# EAGLE schematic Flightcontroller (EAGLE 9.3.2)

## Sheet 1 of 10: STMF722RET6
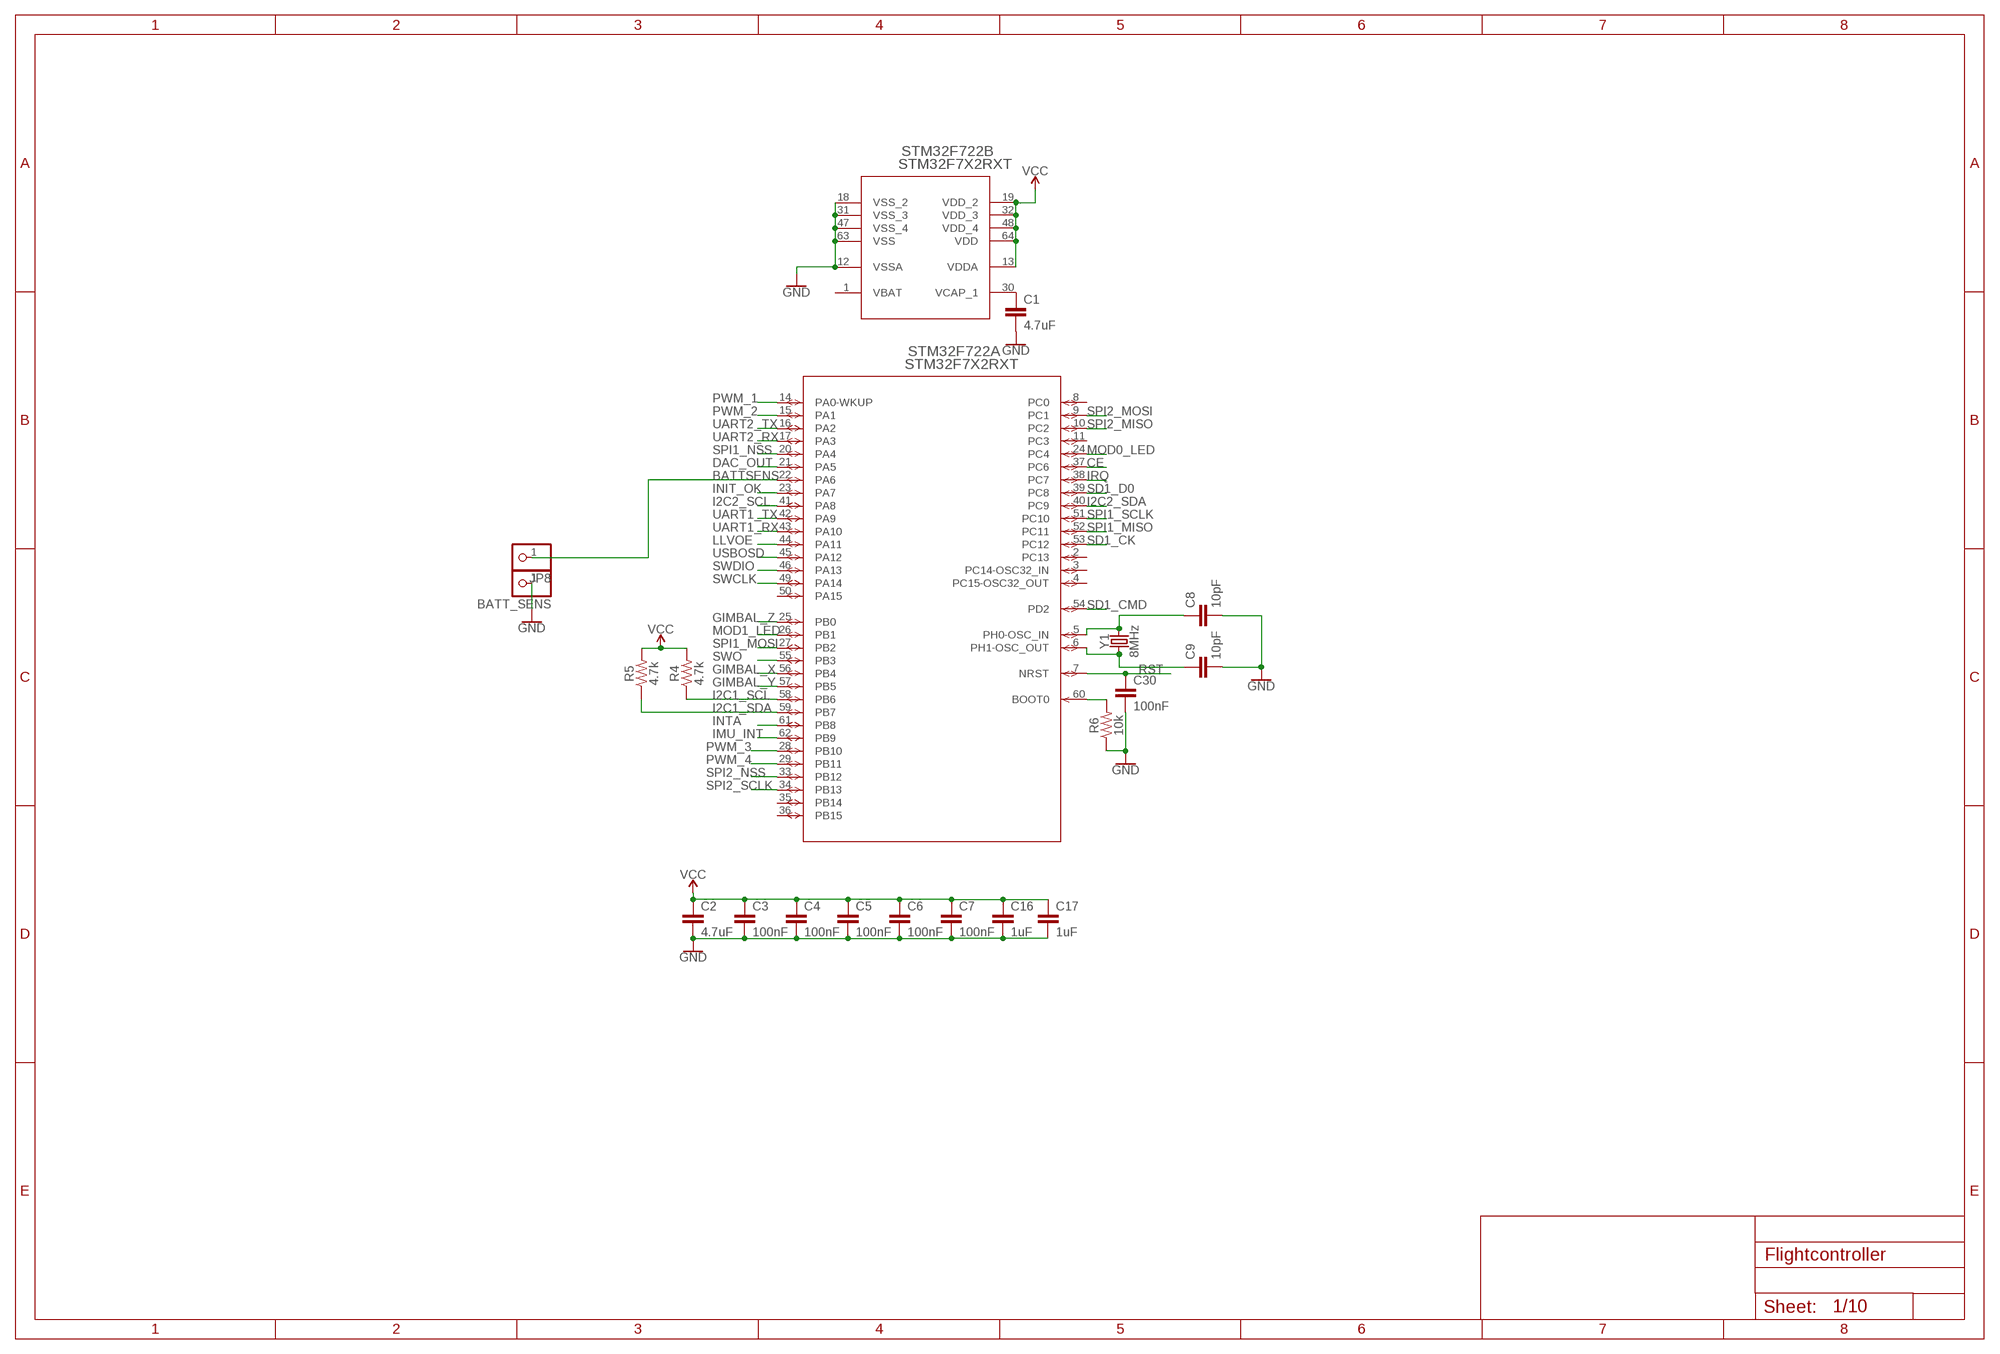
[diagram p0: schematic, sheet 1]

### Parts
BATT_SENS  PINHD-1X1  [1X01]
C1  4.7uF  C-EUC0805  [C0805]
C2  4.7uF  C-EUC0805  [C0805]
C3  100nF  C-EUC0805  [C0805]
C4  100nF  C-EUC0805  [C0805]
C5  100nF  C-EUC0805  [C0805]
C6  100nF  C-EUC0805  [C0805]
C7  100nF  C-EUC0805  [C0805]
C8  10pF  C-EUC0805  [C0805]
C9  10pF  C-EUC0805  [C0805]
C16  1uF  C-EUC0805  [C0805]
C17  1uF  C-EUC0805  [C0805]
C30  100nF  C-EUC0805  [C0805]
JP8  PINHD-1X1  [1X01]
R4  4.7k  4.7KOHM-0603-1/10W-1%  [0603]
R5  4.7k  4.7KOHM-0603-1/10W-1%  [0603]
R6  10k  10KOHM-0603-1/10W-1%  [0603]
STM32F722  STM32F7X2RXT  [LQFP64-10X10MM]
Y1  8MHz  CRYSTAL-8MHZSMD-5X3.2  [CRYSTAL-SMD-5X3.2-4PAD]

### Nets
BATTSENS: JP8.1 STM32F722.22(A:PA6)
CE: STM32F722.37(A:PC6) ; also sheet 5
DAC_OUT: STM32F722.21(A:PA5) ; also sheet 2
GIMBAL_X: STM32F722.56(A:PB4) ; also sheet 2
GIMBAL_Y: STM32F722.57(A:PB5) ; also sheet 2
GIMBAL_Z: STM32F722.25(A:PB0) ; also sheet 2
GND [Supply]: BATT_SENS.1 C1.2 C2.2 C3.2 C4.2 C5.2 C6.2 C7.2 C8.2 C9.2 C16.2 C17.2 C30.2 R6.1 STM32F722.12(B:VSSA) STM32F722.18(B:VSS_2) STM32F722.31(B:VSS_3) STM32F722.47(B:VSS_4) STM32F722.63(B:VSS) ; also sheet 2,3,4,5,6,7,8,9
I2C1_SCL: R4.1 STM32F722.58(A:PB6) ; also sheet 7
I2C1_SDA: R5.1 STM32F722.59(A:PB7) ; also sheet 7
I2C2_SCL: STM32F722.41(A:PA8) ; also sheet 8
I2C2_SDA: STM32F722.40(A:PC9) ; also sheet 8
IMU_INT: STM32F722.62(A:PB9) ; also sheet 7
INIT_OK: STM32F722.23(A:PA7) ; also sheet 2
INTA: STM32F722.61(A:PB8) ; also sheet 7
IRQ: STM32F722.38(A:PC7) ; also sheet 5
LLVOE: STM32F722.44(A:PA11) ; also sheet 9
MOD0_LED: STM32F722.24(A:PC4) ; also sheet 2
MOD1_LED: STM32F722.26(A:PB1) ; also sheet 2
N$1: C1.1 STM32F722.30(B:VCAP_1)
N$2: C8.1 STM32F722.5(A:PH0-OSC_IN) Y1.3
N$3: C9.1 STM32F722.6(A:PH1-OSC_OUT) Y1.1
N$8: R6.2 STM32F722.60(A:BOOT0)
PWM_1: STM32F722.14(A:PA0-WKUP) ; also sheet 2
PWM_2: STM32F722.15(A:PA1) ; also sheet 2
PWM_3: STM32F722.28(A:PB10) ; also sheet 2
PWM_4: STM32F722.29(A:PB11) ; also sheet 2
RST: C30.1 STM32F722.7(A:NRST) ; also sheet 2,6,8
SD1_CK: STM32F722.53(A:PC12) ; also sheet 4
SD1_CMD: STM32F722.54(A:PD2) ; also sheet 4
SD1_D0: STM32F722.39(A:PC8) ; also sheet 4
SPI1_MISO: STM32F722.52(A:PC11) ; also sheet 7
SPI1_MOSI: STM32F722.27(A:PB2) ; also sheet 7
SPI1_NSS: STM32F722.20(A:PA4) ; also sheet 7
SPI1_SCLK: STM32F722.51(A:PC10) ; also sheet 7
SPI2_MISO: STM32F722.10(A:PC2) ; also sheet 5
SPI2_MOSI: STM32F722.9(A:PC1) ; also sheet 5
SPI2_NSS: STM32F722.33(A:PB12) ; also sheet 5
SPI2_SCLK: STM32F722.34(A:PB13) ; also sheet 5
SWCLK: STM32F722.49(A:PA14) ; also sheet 2
SWDIO: STM32F722.46(A:PA13) ; also sheet 2
SWO: STM32F722.55(A:PB3) ; also sheet 2
UART1_RX: STM32F722.43(A:PA10) ; also sheet 2,6
UART1_TX: STM32F722.42(A:PA9) ; also sheet 2,6
UART2_RX: STM32F722.17(A:PA3) ; also sheet 2
UART2_TX: STM32F722.16(A:PA2) ; also sheet 2
USBOSD: STM32F722.45(A:PA12) ; also sheet 2
VCC [Supply]: C2.1 C3.1 C4.1 C5.1 C6.1 C7.1 C16.1 C17.1 R4.2 R5.2 STM32F722.13(B:VDDA) STM32F722.19(B:VDD_2) STM32F722.32(B:VDD_3) STM32F722.48(B:VDD_4) STM32F722.64(B:VDD) ; also sheet 2,3,4,5,6,7,8,9
Unconnected: STM32F722.2(A:PC13) STM32F722.3(A:PC14-OSC32_IN) STM32F722.4(A:PC15-OSC32_OUT) STM32F722.8(A:PC0) STM32F722.11(A:PC3) STM32F722.35(A:PB14) STM32F722.36(A:PB15) STM32F722.50(A:PA15)

## Sheet 2 of 10: Pinheaders and LED
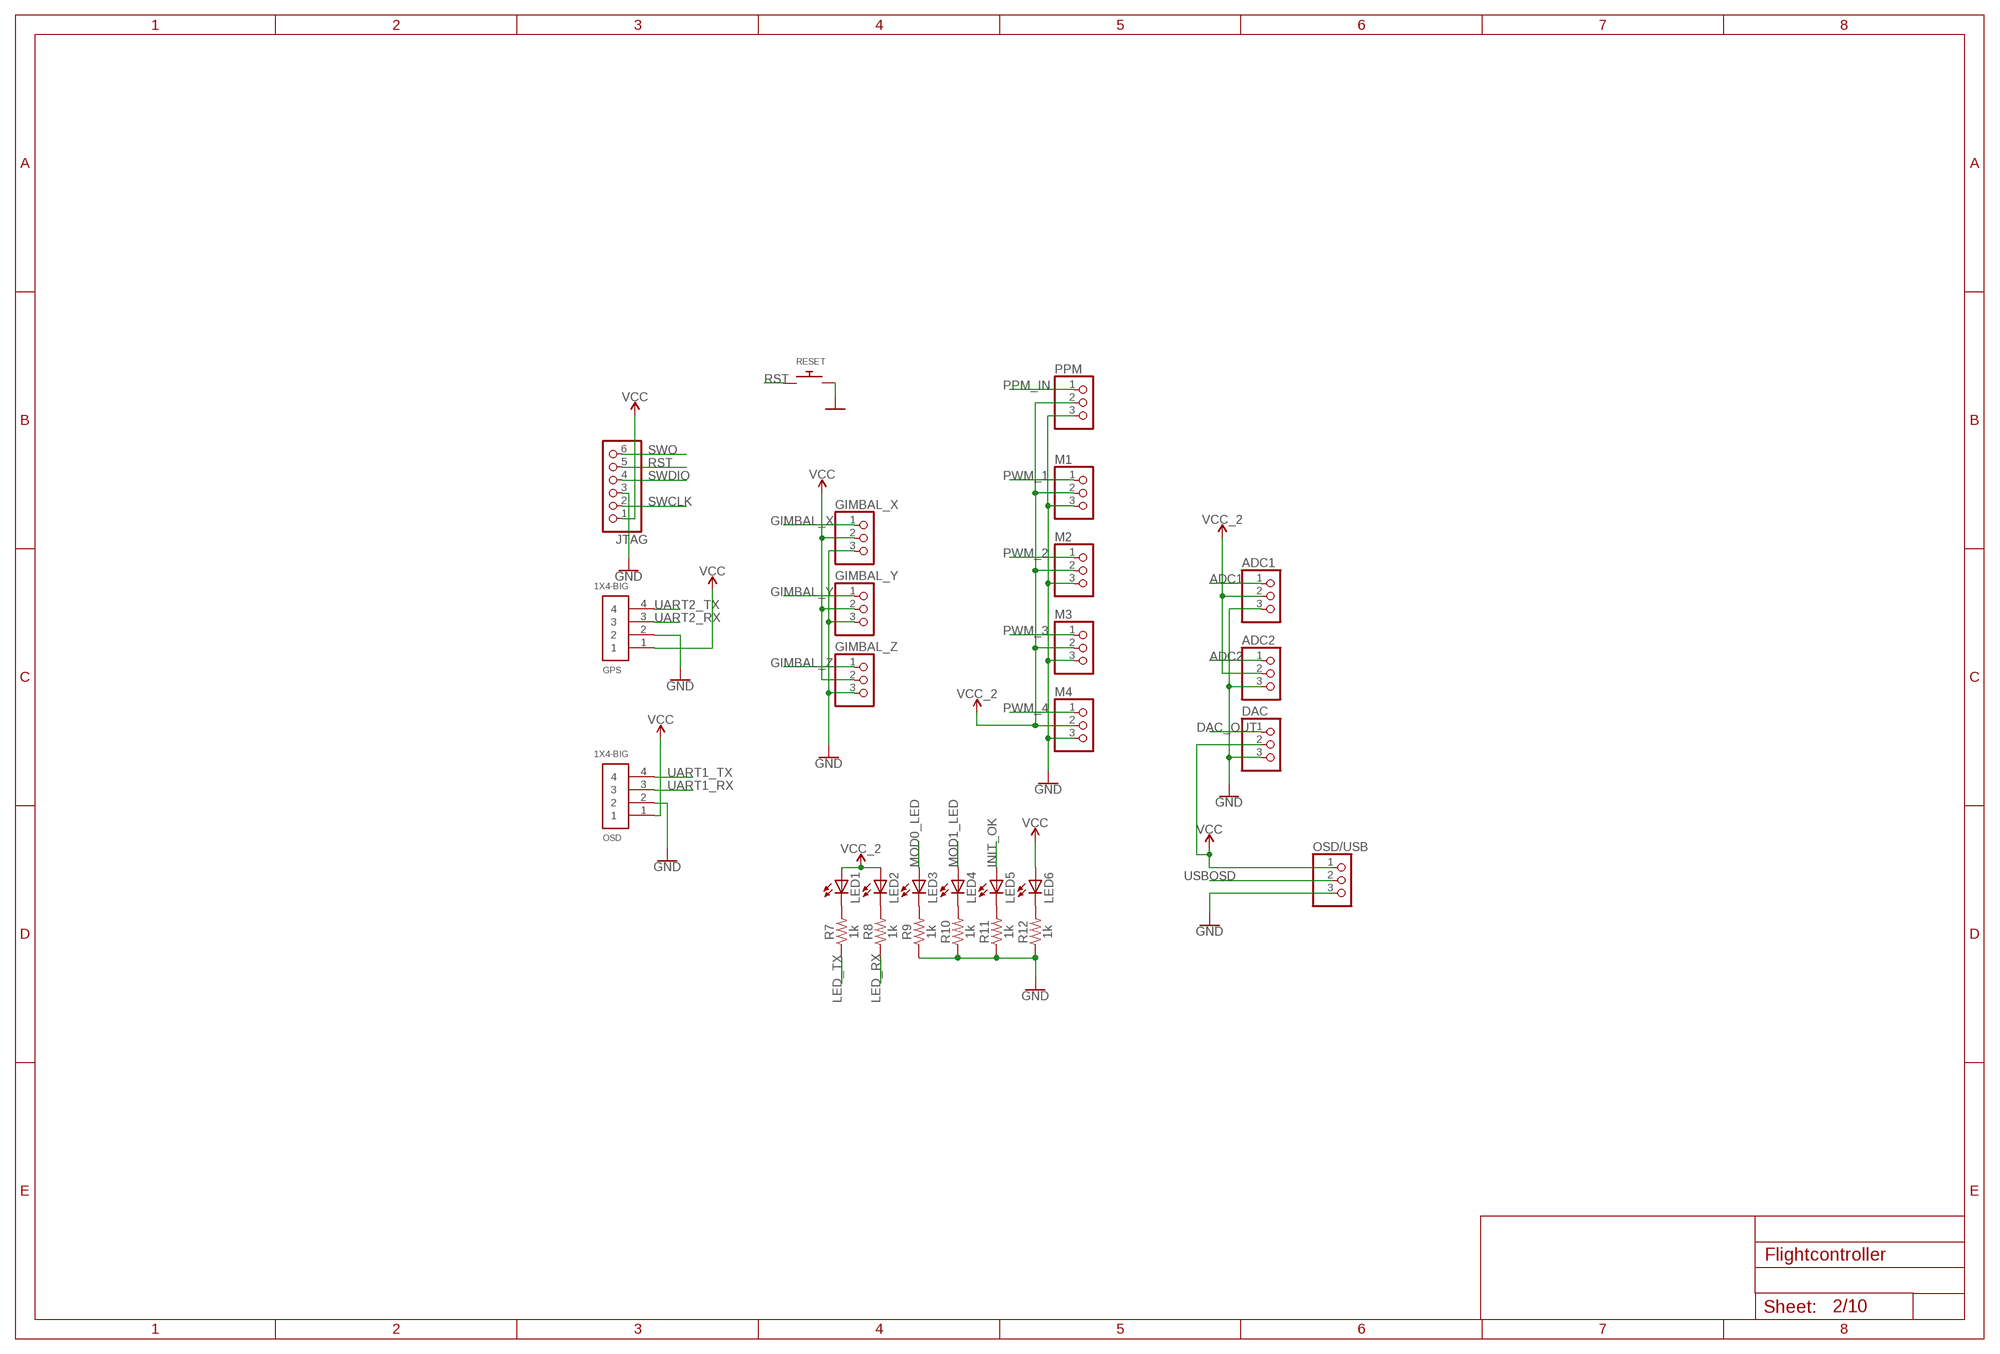
[diagram p1: schematic, sheet 2]

### Parts
ADC1  PINHD-1X3  [1X03]
ADC2  PINHD-1X3  [1X03]
DAC  PINHD-1X3  [1X03]
GIMBAL_X  PINHD-1X3  [1X03]
GIMBAL_Y  PINHD-1X3  [1X03]
GIMBAL_Z  PINHD-1X3  [1X03]
GPS  1X4-BIG  [1X04-BIG]
JTAG  PINHD-1X6  [1X06]
LED1  LEDSMT1206  [1206]
LED2  LEDSMT1206  [1206]
LED3  LEDSMT1206  [1206]
LED4  LEDSMT1206  [1206]
LED5  LEDSMT1206  [1206]
LED6  LEDSMT1206  [1206]
M1  PINHD-1X3  [1X03]
M2  PINHD-1X3  [1X03]
M3  PINHD-1X3  [1X03]
M4  PINHD-1X3  [1X03]
OSD  1X4-BIG  [1X04-BIG]
OSD/USB  PINHD-1X3  [1X03]
PPM  PINHD-1X3  [1X03]
R7  1k  10KOHM-0603-1/10W-1%  [0603]
R8  1k  10KOHM-0603-1/10W-1%  [0603]
R9  1k  10KOHM-0603-1/10W-1%  [0603]
R10  1k  10KOHM-0603-1/10W-1%  [0603]
R11  1k  10KOHM-0603-1/10W-1%  [0603]
R12  1k  10KOHM-0603-1/10W-1%  [0603]
RESET  SWITCH_PUSHBUTTONC&K_KSS  [BTN_CK_KSS]

### Nets
ADC1: ADC1.1 ; also sheet 8
ADC2: ADC2.1 ; also sheet 8
DAC_OUT: DAC.1 ; also sheet 1
GIMBAL_X: GIMBAL_X.1 ; also sheet 1
GIMBAL_Y: GIMBAL_Y.1 ; also sheet 1
GIMBAL_Z: GIMBAL_Z.1 ; also sheet 1
GND [Supply]: ADC1.3 ADC2.3 DAC.3 GIMBAL_X.3 GIMBAL_Y.3 GIMBAL_Z.3 GPS.2 JTAG.3 M1.3 M2.3 M3.3 M4.3 OSD.2 OSD/USB.3 PPM.3 R9.1 R10.1 R11.1 R12.1 RESET.P$2 ; also sheet 1,3,4,5,6,7,8,9
INIT_OK: LED5.A ; also sheet 1
LED_RX: R8.1 ; also sheet 6
LED_TX: R7.1 ; also sheet 6
MOD0_LED: LED3.A ; also sheet 1
MOD1_LED: LED4.A ; also sheet 1
N$13: LED1.C R7.2
N$14: LED2.C R8.2
N$15: LED3.C R9.2
N$16: LED4.C R10.2
N$17: LED5.C R11.2
N$18: LED6.C R12.2
PPM_IN: PPM.1 ; also sheet 8
PWM_1: M1.1 ; also sheet 1
PWM_2: M2.1 ; also sheet 1
PWM_3: M3.1 ; also sheet 1
PWM_4: M4.1 ; also sheet 1
RST: JTAG.5 RESET.P$1 ; also sheet 1,6,8
SWCLK: JTAG.2 ; also sheet 1
SWDIO: JTAG.4 ; also sheet 1
SWO: JTAG.6 ; also sheet 1
UART1_RX: OSD.3 ; also sheet 1,6
UART1_TX: OSD.4 ; also sheet 1,6
UART2_RX: GPS.3 ; also sheet 1
UART2_TX: GPS.4 ; also sheet 1
USBOSD: OSD/USB.2 ; also sheet 1
VCC [Supply]: DAC.2 GIMBAL_X.2 GIMBAL_Y.2 GIMBAL_Z.2 GPS.1 JTAG.1 LED6.A OSD.1 OSD/USB.1 ; also sheet 1,3,4,5,6,7,8,9
VCC_2 [Supply]: ADC1.2 ADC2.2 LED1.A LED2.A M1.2 M2.2 M3.2 M4.2 PPM.2 ; also sheet 3,6,8,9

## Sheet 3 of 10: 3.3V LDO LM3940IMPX
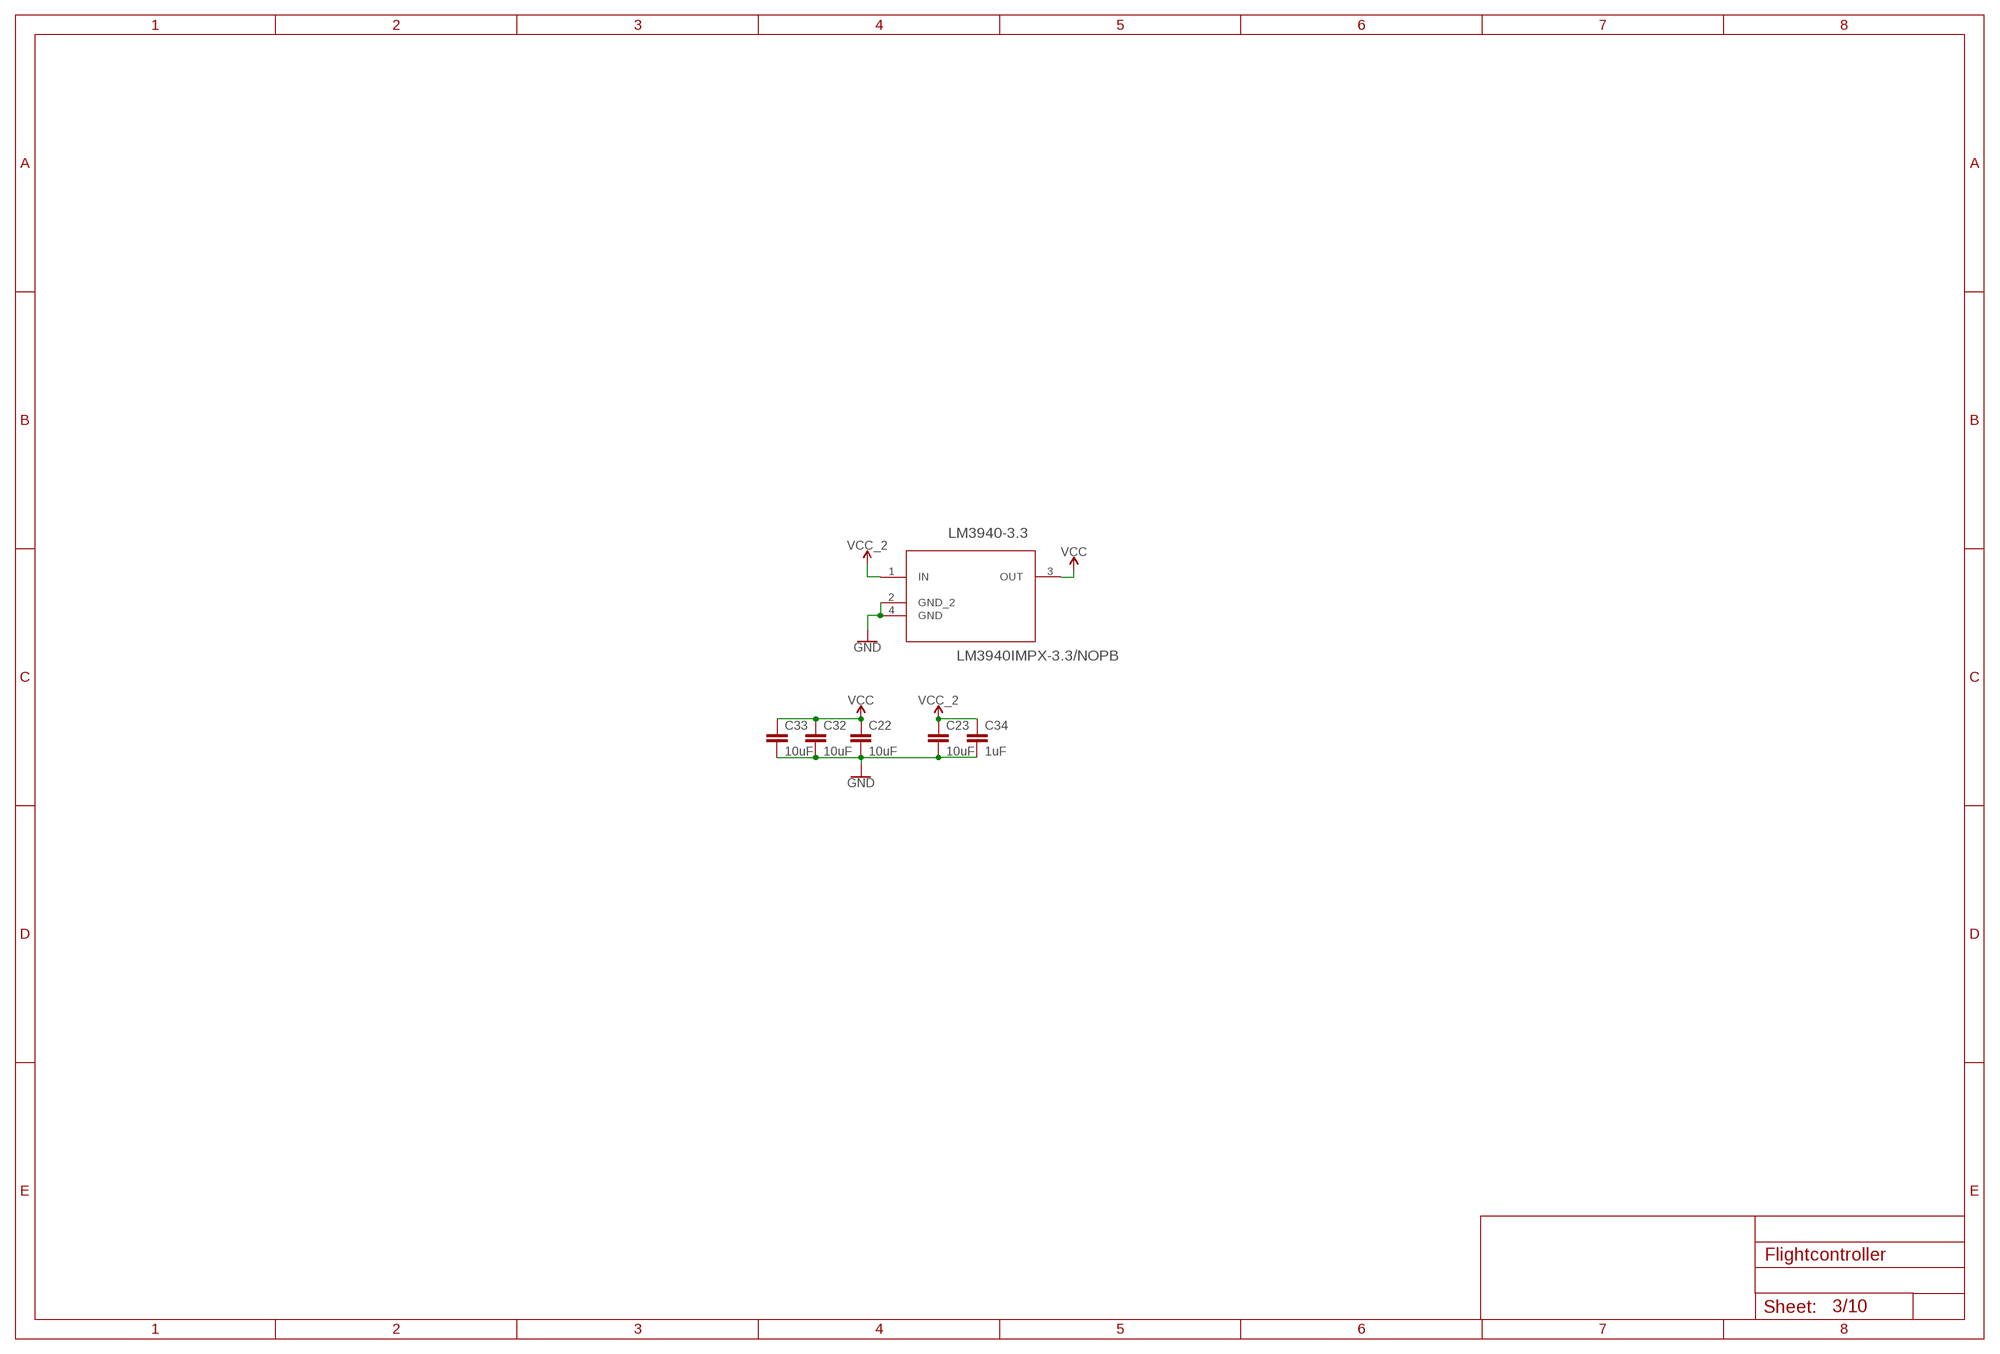
[diagram p2: schematic, sheet 3]

### Parts
C22  10uF  C-EUC0805  [C0805]
C23  10uF  C-EUC0805  [C0805]
C32  10uF  C-EUC0805  [C0805]
C33  10uF  C-EUC0805  [C0805]
C34  1uF  C-EUC0805  [C0805]
LM3940-3.3  LM3940IMPX-3.3/NOPB  [SOT230P696X180-4N]

### Nets
GND [Supply]: C22.2 C23.2 C32.2 C33.2 C34.2 LM3940-3.3.2(GND_2) LM3940-3.3.4(GND) ; also sheet 1,2,4,5,6,7,8,9
VCC [Supply]: C22.1 C32.1 C33.1 LM3940-3.3.3(OUT) ; also sheet 1,2,4,5,6,7,8,9
VCC_2 [Supply]: C23.1 C34.1 LM3940-3.3.1(IN) ; also sheet 2,6,8,9

## Sheet 4 of 10: microSD-Card connector female
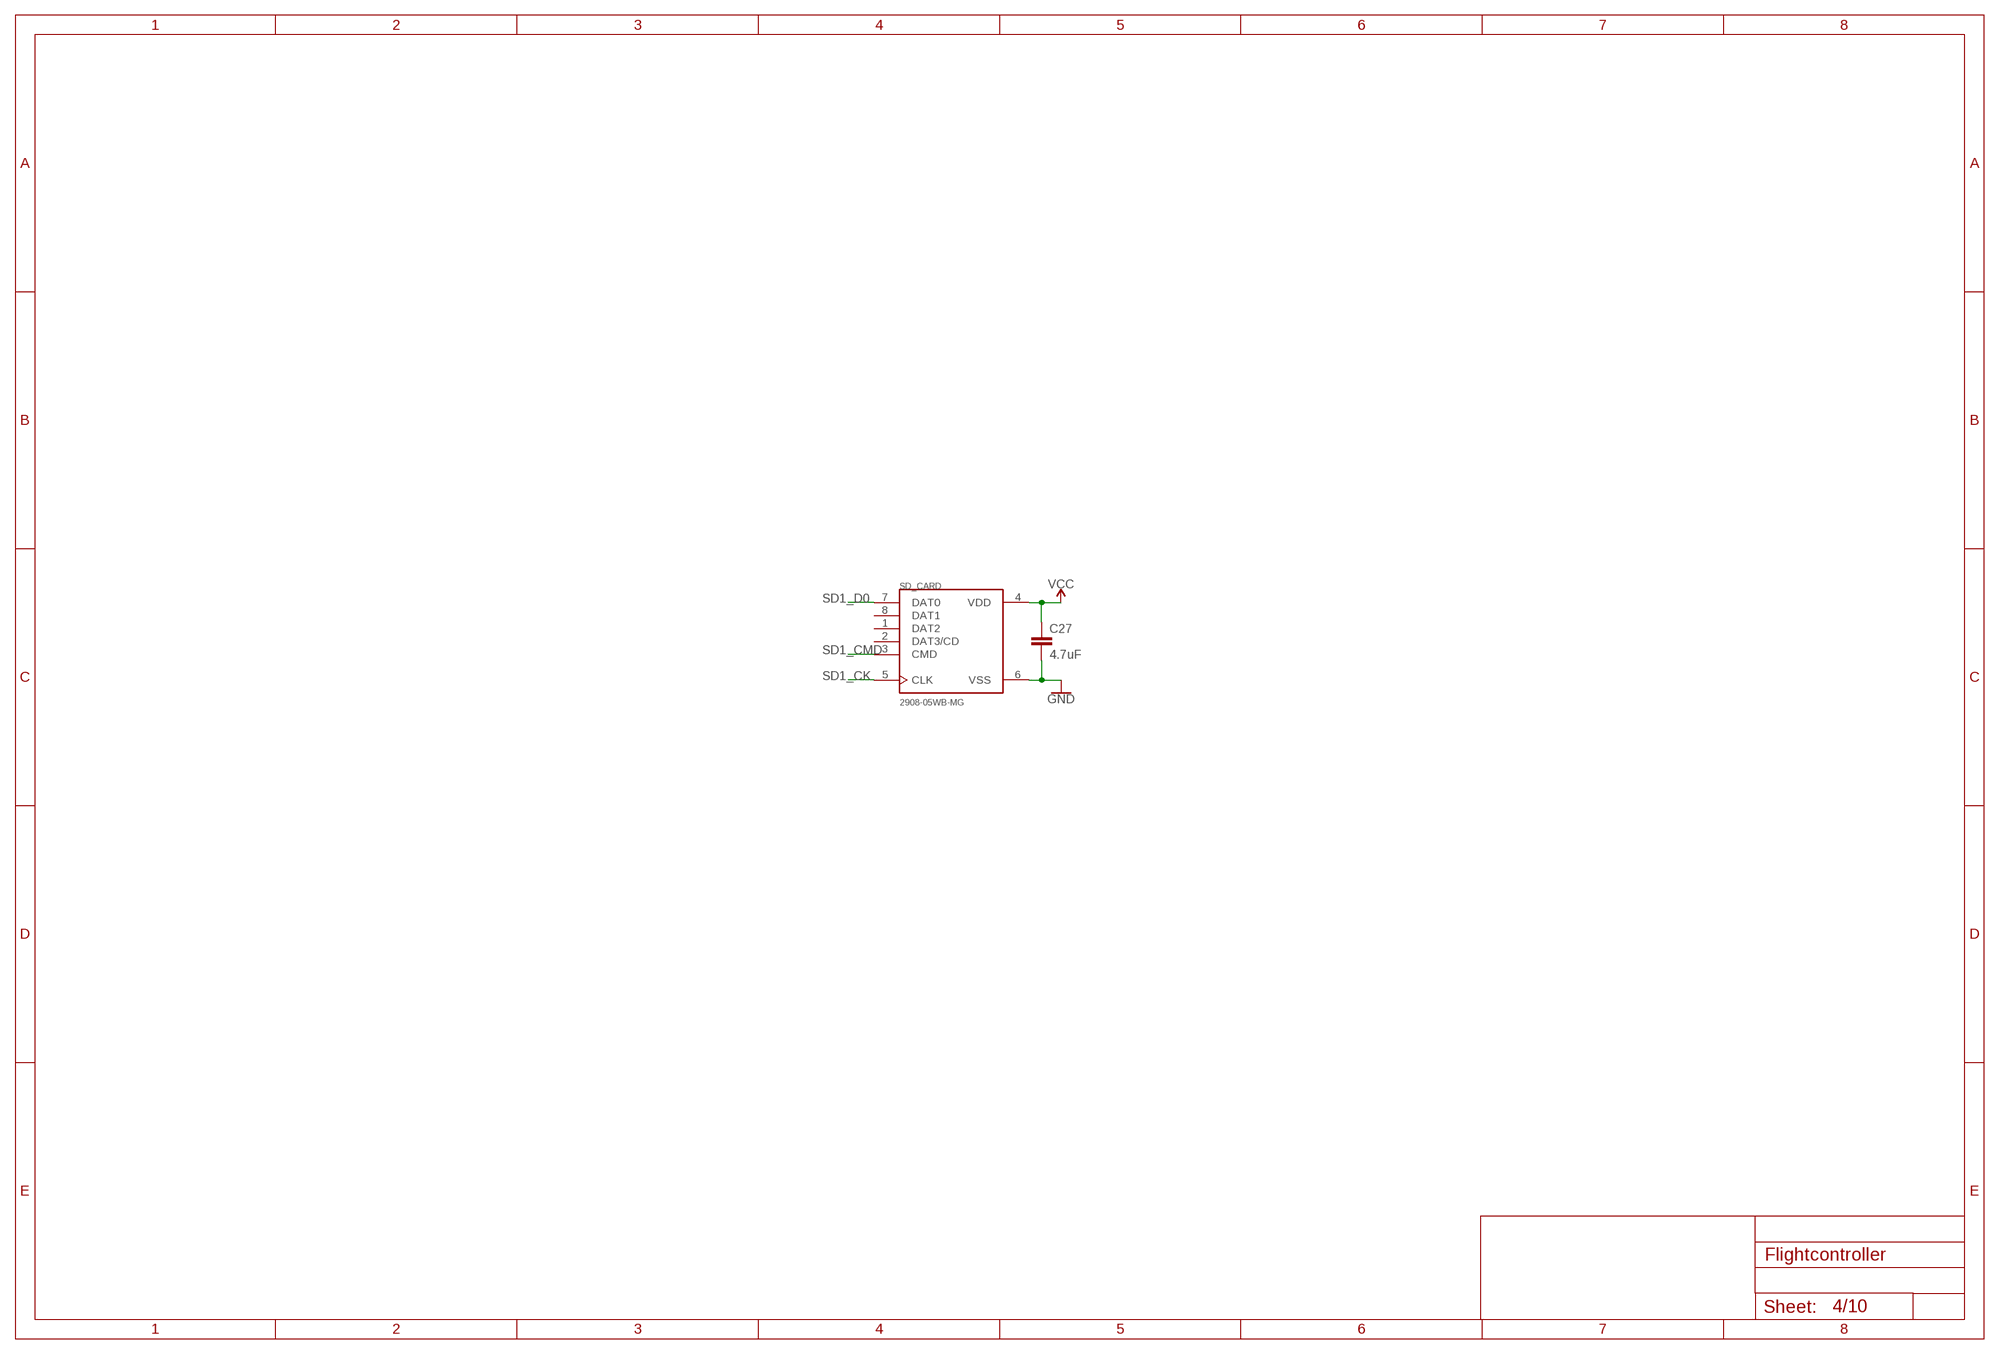
[diagram p3: schematic, sheet 4]

### Parts
C27  4.7uF  C-EUC0805  [C0805]
SD_CARD  2908-05WB-MG  [3M_2908-05WB-MG]

### Nets
GND [Supply]: C27.2 SD_CARD.6(VSS) ; also sheet 1,2,3,5,6,7,8,9
SD1_CK: SD_CARD.5(CLK) ; also sheet 1
SD1_CMD: SD_CARD.3(CMD) ; also sheet 1
SD1_D0: SD_CARD.7(DAT0) ; also sheet 1
VCC [Supply]: C27.1 SD_CARD.4(VDD) ; also sheet 1,2,3,5,6,7,8,9
Unconnected: SD_CARD.1(DAT2) SD_CARD.2(DAT3/CD) SD_CARD.8(DAT1)

## Sheet 5 of 10: 2.4Ghz nRF24L01 receiver
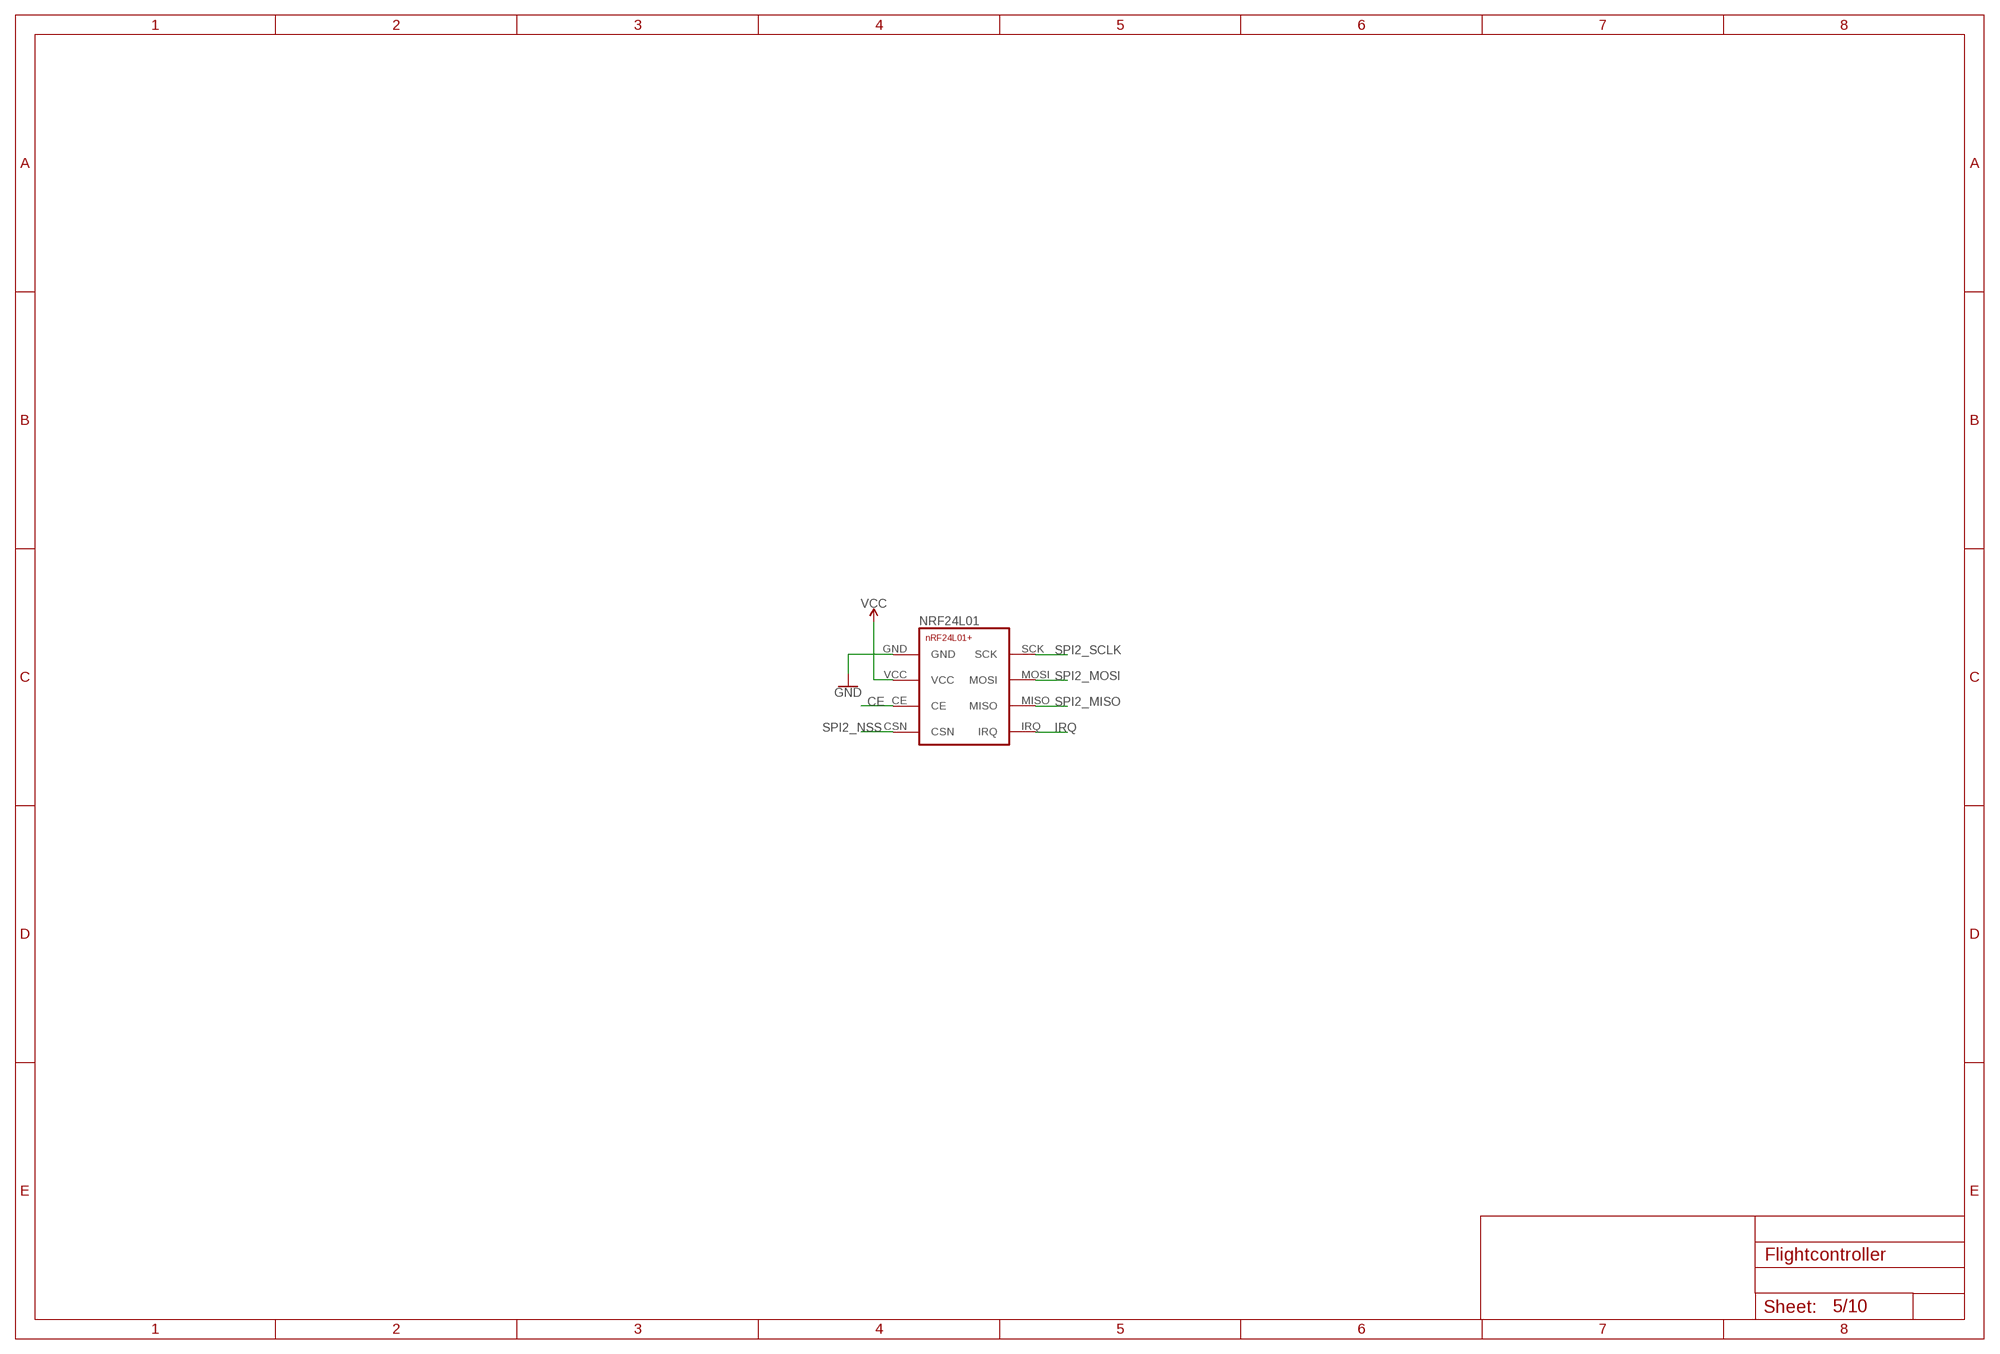
[diagram p4: schematic, sheet 5]

### Parts
NRF24L01  NRF24L01+  [NRF24L01+]

### Nets
CE: NRF24L01.CE ; also sheet 1
GND [Supply]: NRF24L01.GND ; also sheet 1,2,3,4,6,7,8,9
IRQ: NRF24L01.IRQ ; also sheet 1
SPI2_MISO: NRF24L01.MISO ; also sheet 1
SPI2_MOSI: NRF24L01.MOSI ; also sheet 1
SPI2_NSS: NRF24L01.CSN ; also sheet 1
SPI2_SCLK: NRF24L01.SCK ; also sheet 1
VCC [Supply]: NRF24L01.VCC ; also sheet 1,2,3,4,6,7,8,9

## Sheet 6 of 10: UART to USB FTDI FT232RL
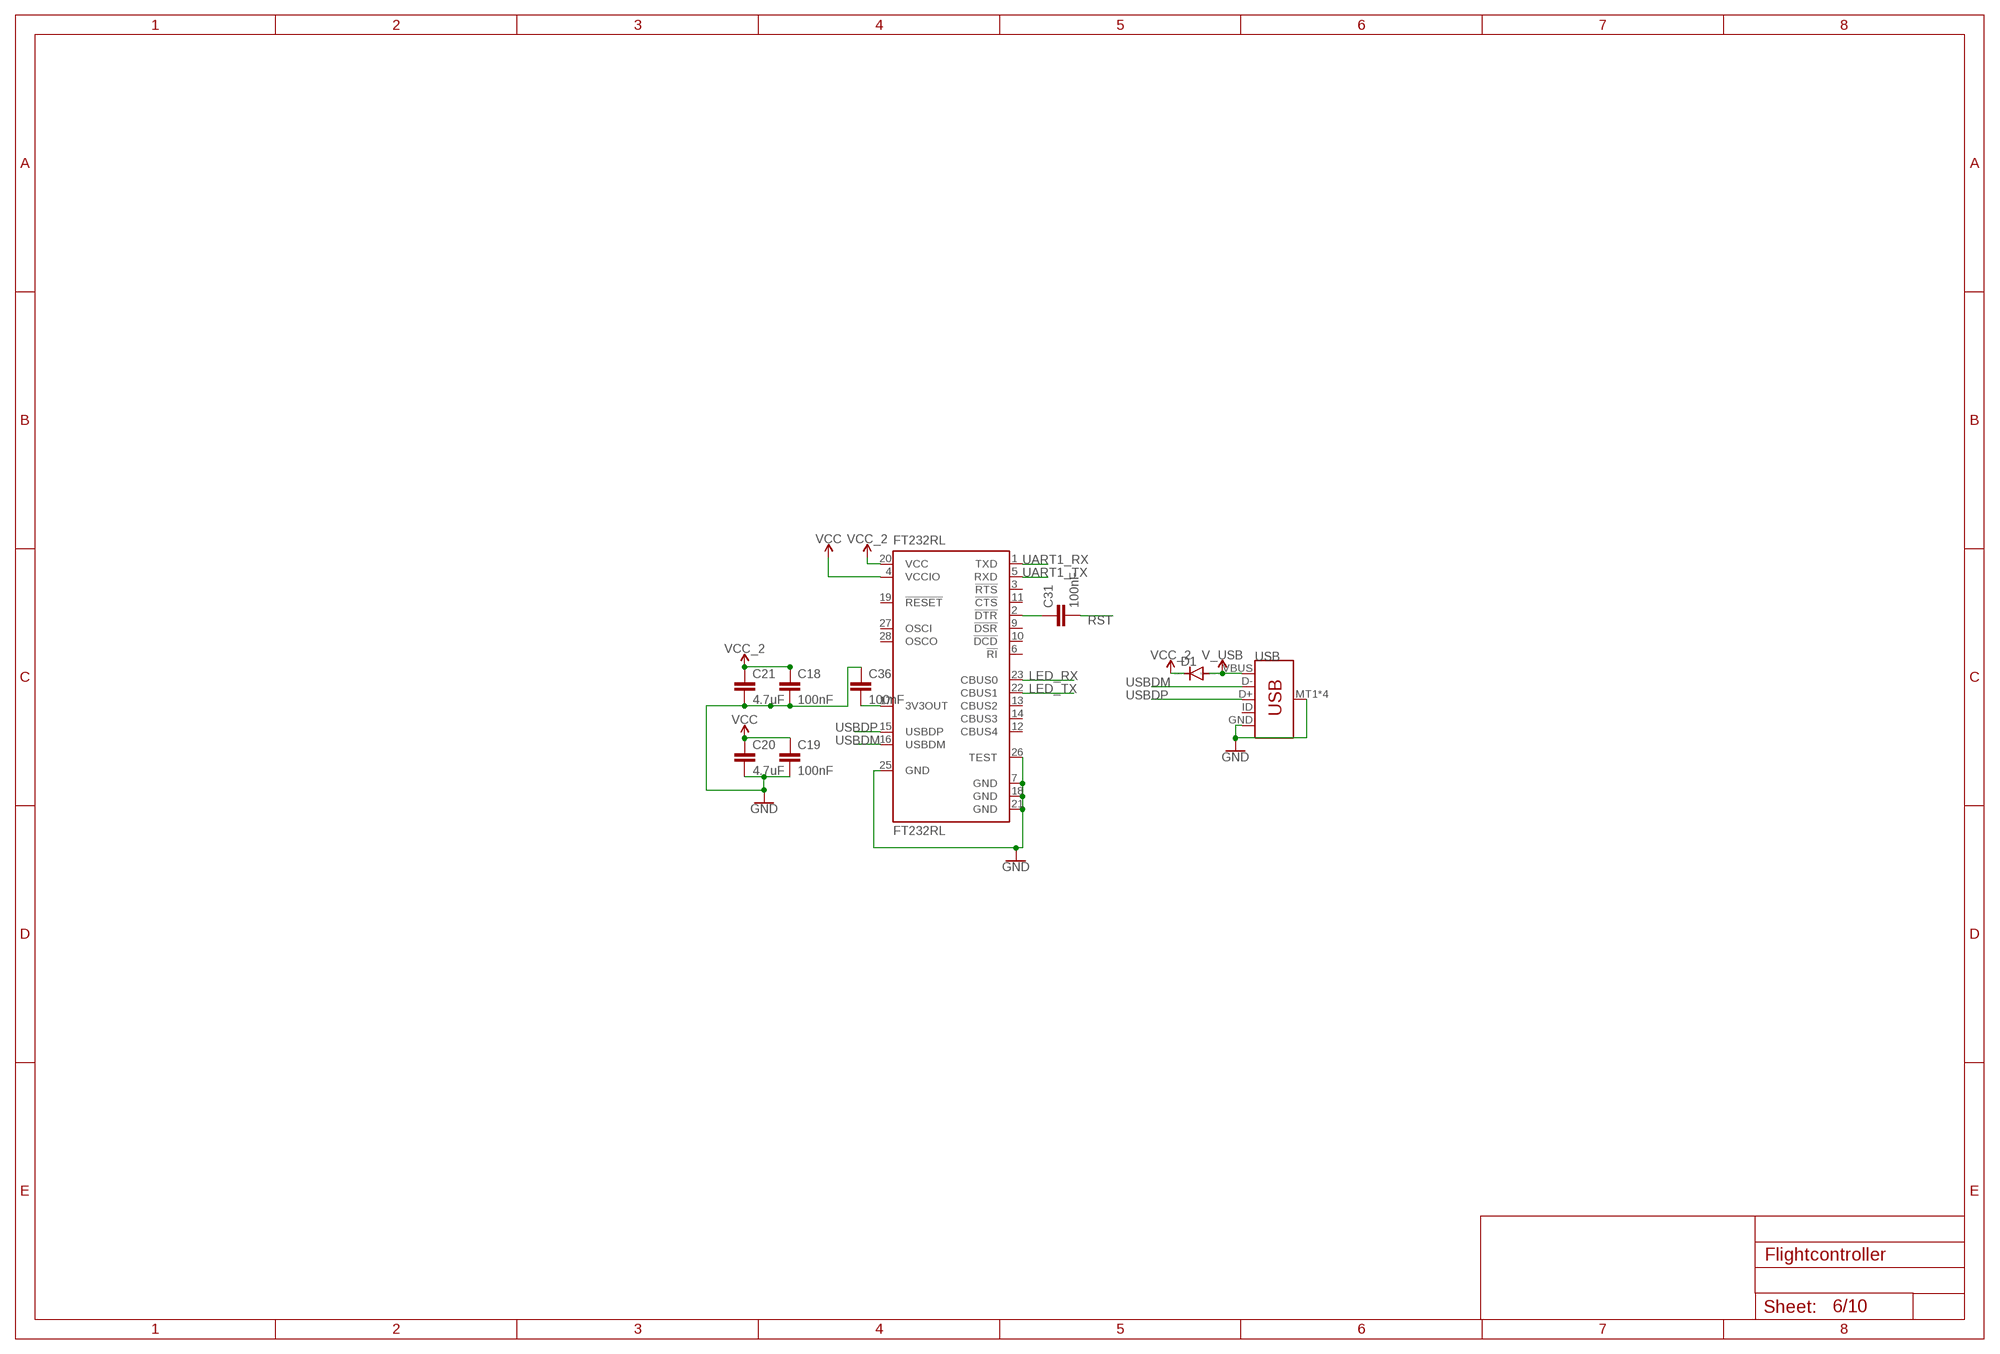
[diagram p5: schematic, sheet 6]

### Parts
C18  100nF  C-EUC0805  [C0805]
C19  100nF  C-EUC0805  [C0805]
C20  4.7uF  C-EUC0805  [C0805]
C21  4.7uF  C-EUC0805  [C0805]
C31  100nF  C-EUC0805  [C0805]
C36  100nF  C-EUC0805  [C0805]
D1  DIODE-DO214BA  [DO214BA]
FT232RL  FT232RL  [SSOP28]
USB  USB_MICRO-B_SMT  [USB-MICROB]

### Nets
GND [Supply]: C18.2 C19.2 C20.2 C21.2 C36.1 FT232RL.7(GND) FT232RL.18(GND) FT232RL.21(GND) FT232RL.25(GND) FT232RL.26(TEST) USB.GND USB.MT1(SHIELD) USB.MT2(SHIELD) USB.P$1(SHIELD) USB.P$2(SHIELD) ; also sheet 1,2,3,4,5,7,8,9
LED_RX: FT232RL.23(CBUS0) ; also sheet 2
LED_TX: FT232RL.22(CBUS1) ; also sheet 2
N$9: C31.1 FT232RL.2(!DTR)
N$10: C36.2 FT232RL.17(3V3OUT)
RST: C31.2 ; also sheet 1,2,8
UART1_RX: FT232RL.1(TXD) ; also sheet 1,2
UART1_TX: FT232RL.5(RXD) ; also sheet 1,2
USBDM: FT232RL.16(USBDM) USB.D-
USBDP: FT232RL.15(USBDP) USB.D+
V_USB: D1.A USB.VBUS
VCC [Supply]: C19.1 C20.1 FT232RL.4(VCCIO) ; also sheet 1,2,3,4,5,7,8,9
VCC_2 [Supply]: C18.1 C21.1 D1.C FT232RL.20(VCC) ; also sheet 2,3,8,9
Unconnected: FT232RL.3(!RTS) FT232RL.6(!RI) FT232RL.9(!DSR) FT232RL.10(!DCD) FT232RL.11(!CTS) FT232RL.12(CBUS4) FT232RL.13(CBUS2) FT232RL.14(CBUS3) FT232RL.19(!RESET) FT232RL.27(OSCI) FT232RL.28(OSCO) USB.ID

## Sheet 7 of 10: IMU MPU6000 and GY87 with MPU6050
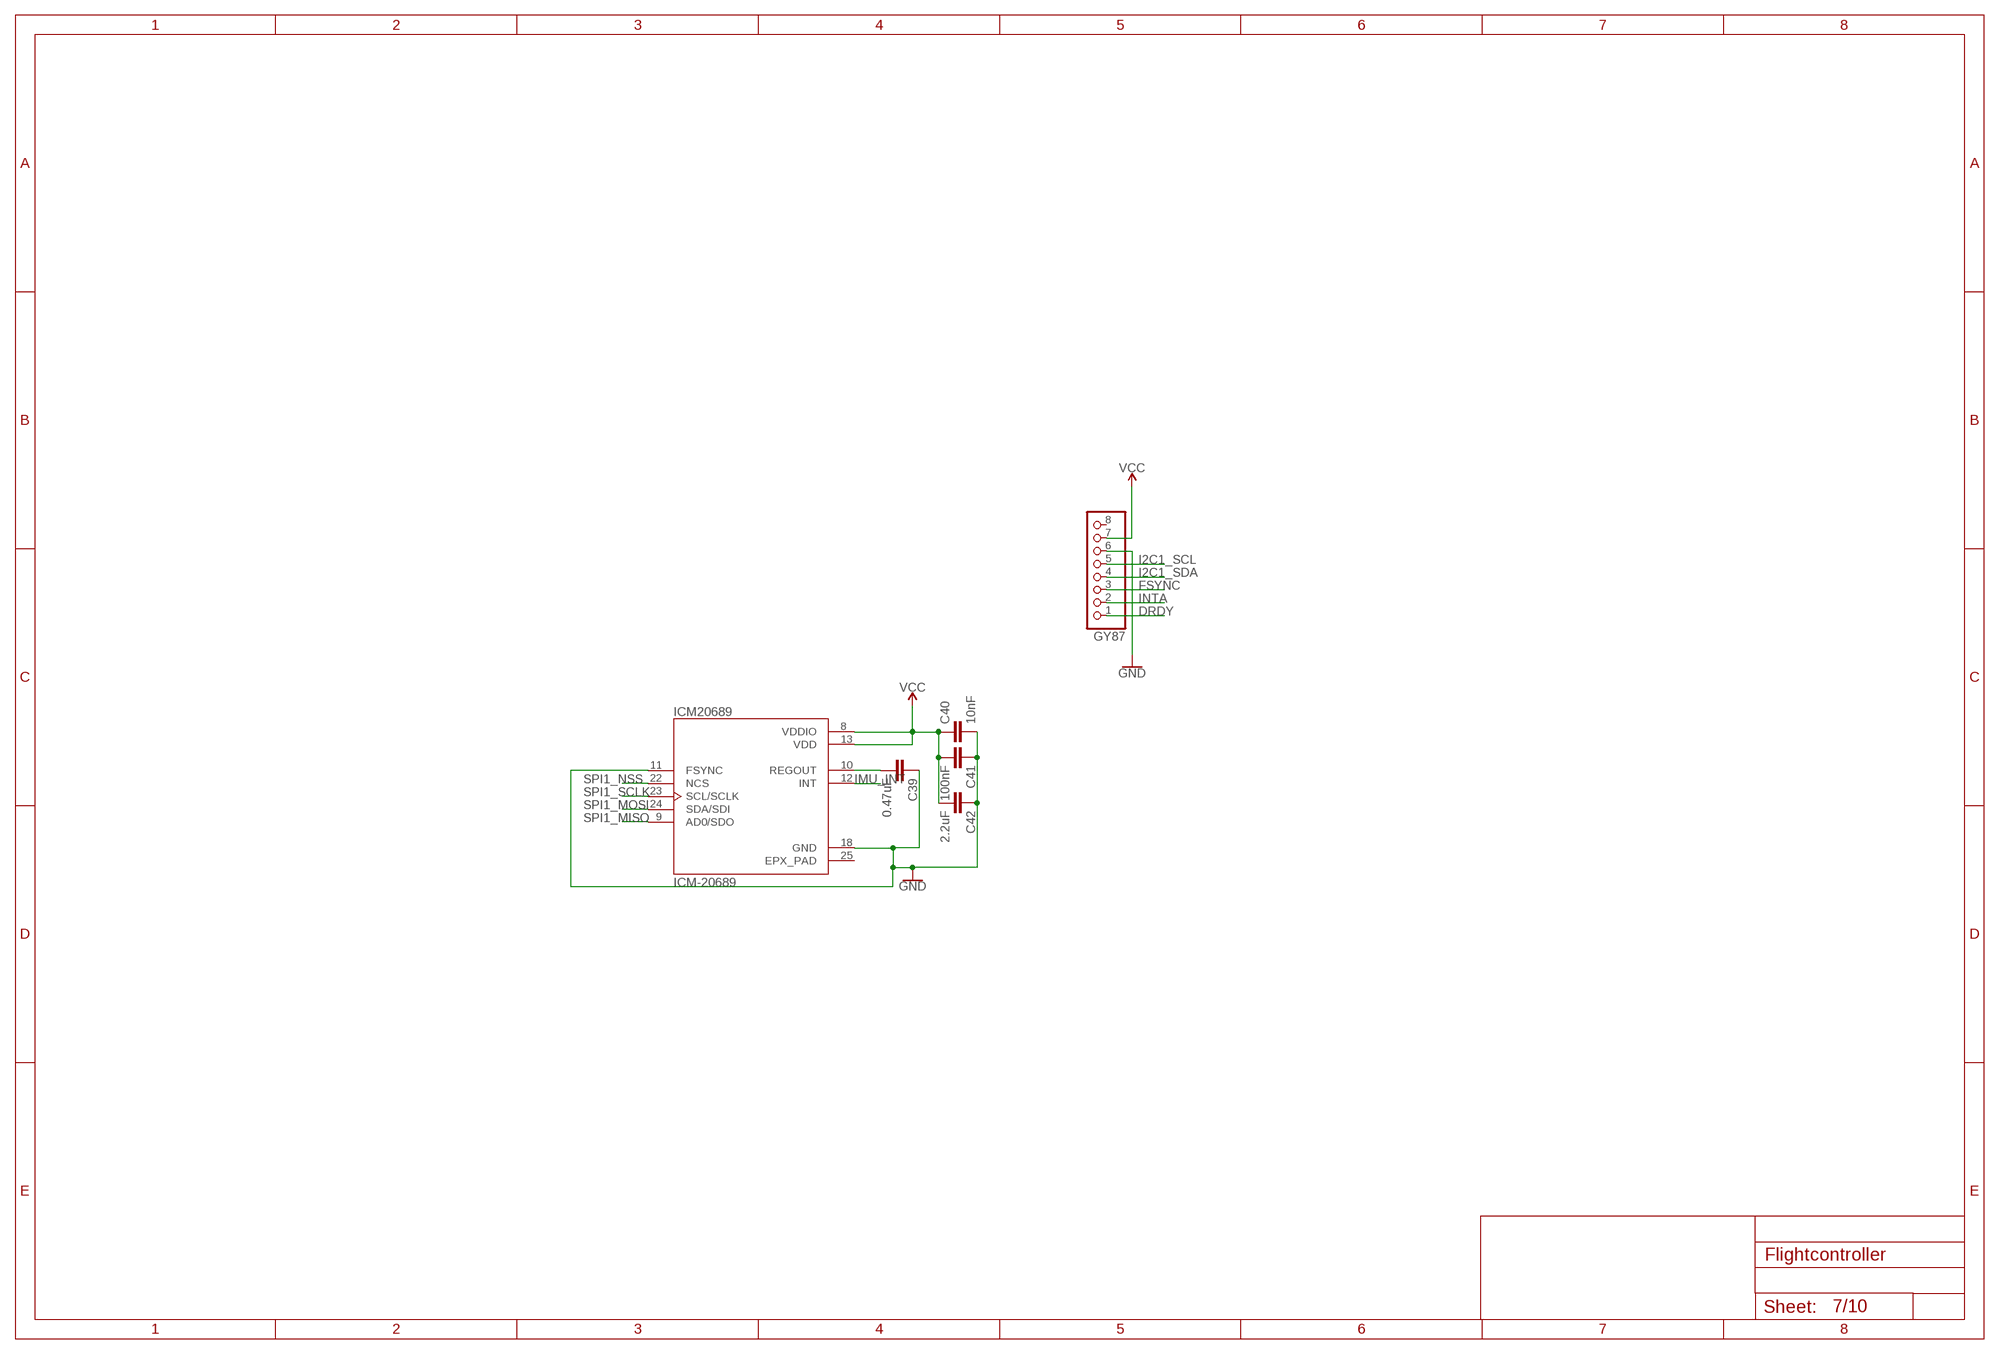
[diagram p6: schematic, sheet 7]

### Parts
C39  0.47uF  C-EUC0805  [C0805]
C40  10nF  C-EUC0805  [C0805]
C41  100nF  C-EUC0805  [C0805]
C42  2.2uF  C-EUC0805  [C0805]
GY87  PINHD-1X8CLEANBIG  [1X08-CLEANBIG]
ICM20689  ICM-20689  [QFN50P400X400X95-25N]

### Nets
DRDY: GY87.1
FSYNC: GY87.3
GND [Supply]: C39.1 C40.2 C41.1 C42.1 GY87.6 ICM20689.11(FSYNC) ICM20689.18(GND) ; also sheet 1,2,3,4,5,6,8,9
I2C1_SCL: GY87.5 ; also sheet 1
I2C1_SDA: GY87.4 ; also sheet 1
IMU_INT: ICM20689.12(INT) ; also sheet 1
INTA: GY87.2 ; also sheet 1
N$24: C39.2 ICM20689.10(REGOUT)
SPI1_MISO: ICM20689.9(AD0/SDO) ; also sheet 1
SPI1_MOSI: ICM20689.24(SDA/SDI) ; also sheet 1
SPI1_NSS: ICM20689.22(NCS) ; also sheet 1
SPI1_SCLK: ICM20689.23(SCL/SCLK) ; also sheet 1
VCC [Supply]: C40.1 C41.2 C42.2 GY87.7 ICM20689.8(VDDIO) ICM20689.13(VDD) ; also sheet 1,2,3,4,5,6,8,9
Unconnected: GY87.8

## Sheet 8 of 10: ATMega328P with Ultrasconic connector
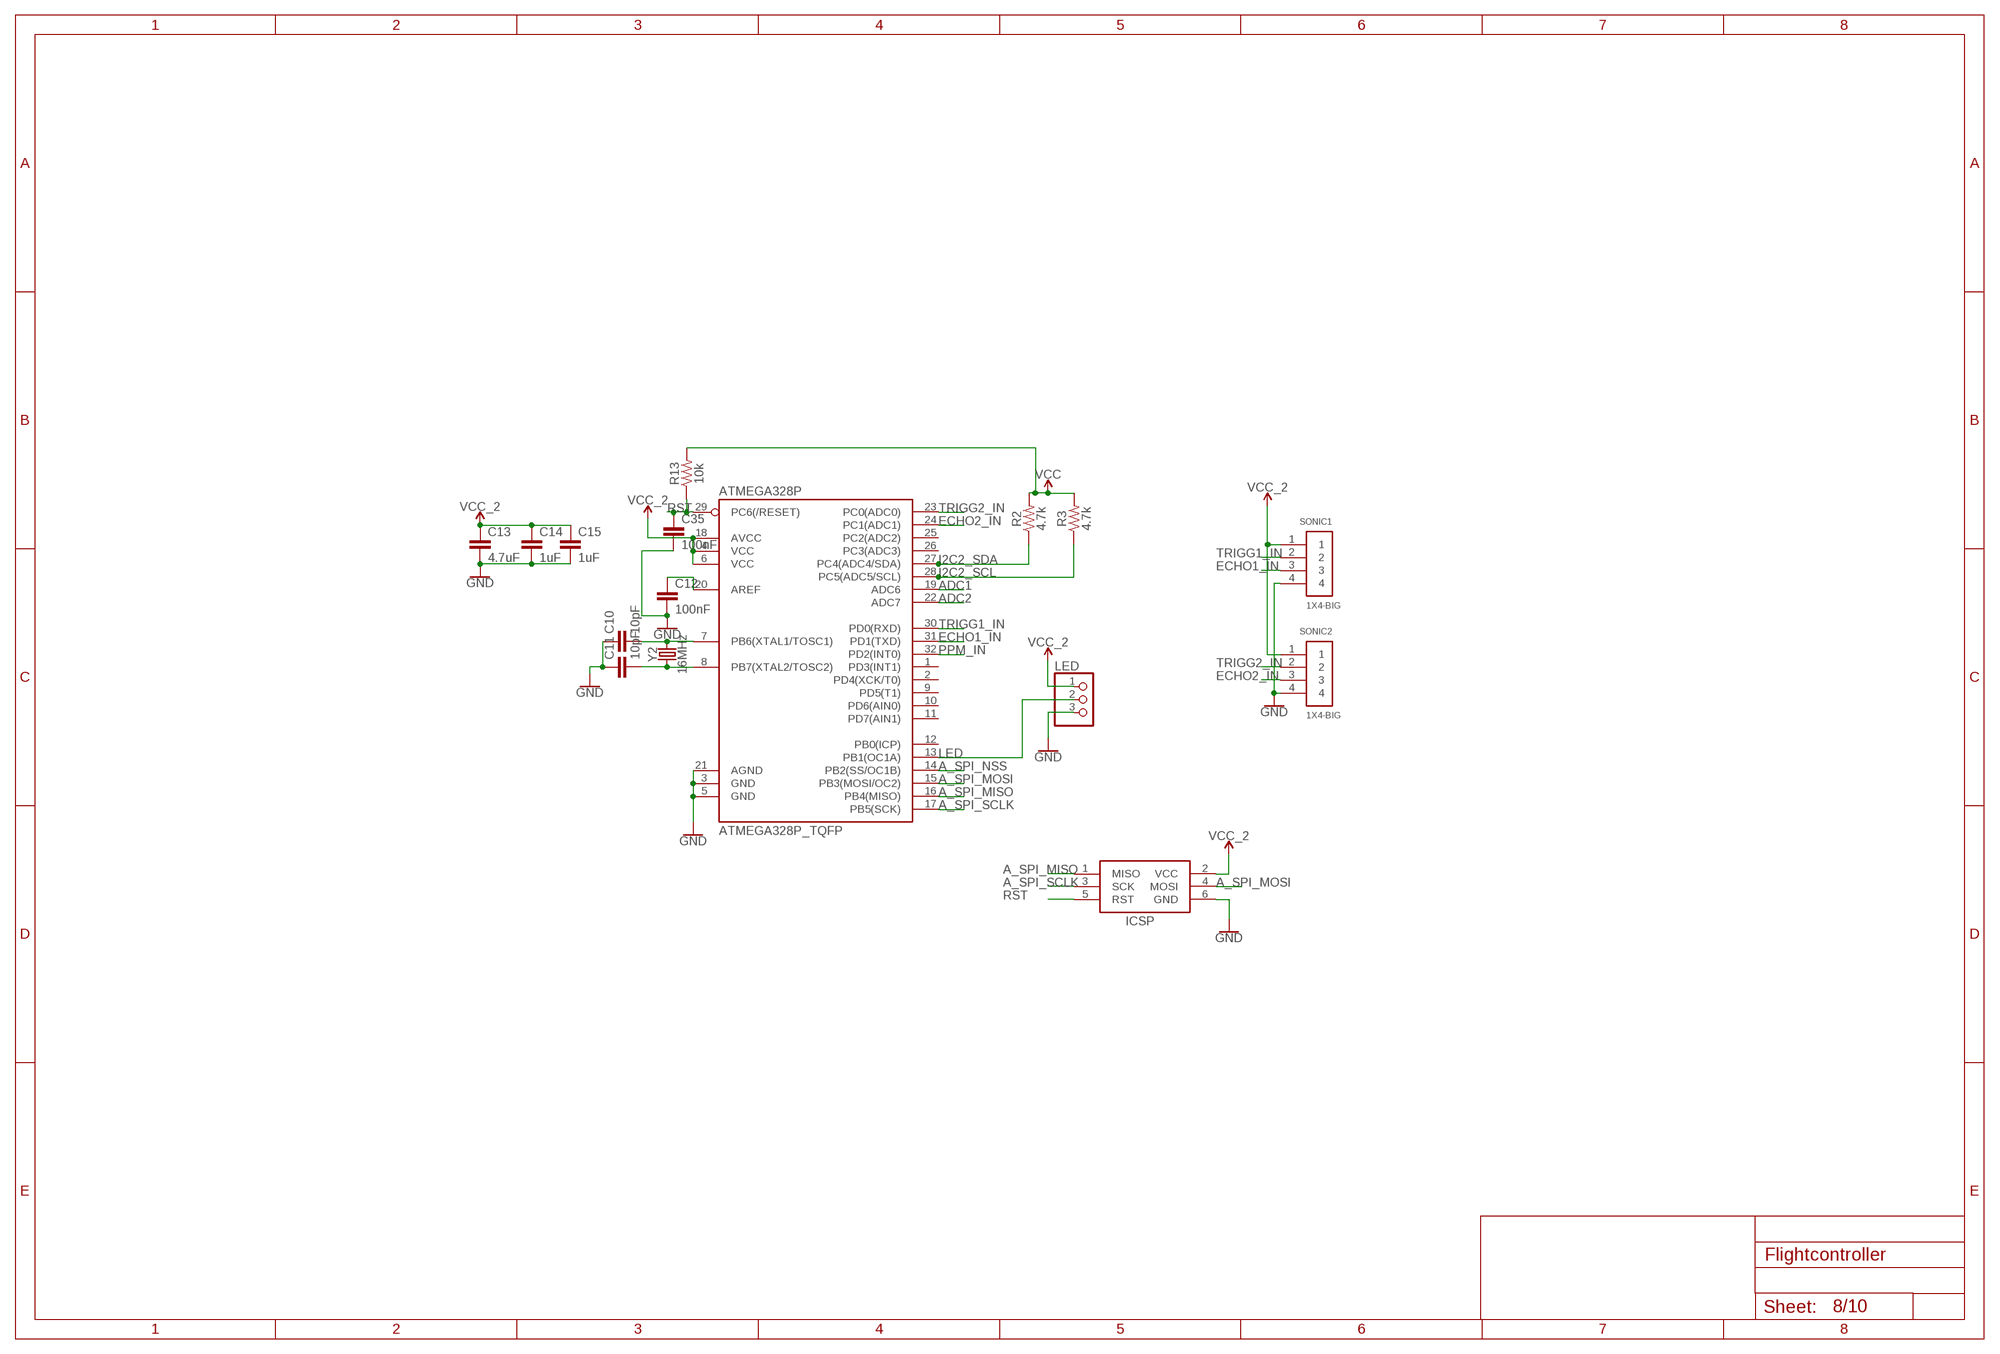
[diagram p7: schematic, sheet 8]

### Parts
ATMEGA328P  ATMEGA328P_TQFP  [TQFP32-08]
C10  10pF  C-EUC0805  [C0805]
C11  10pF  C-EUC0805  [C0805]
C12  100nF  C-EUC0805  [C0805]
C13  4.7uF  C-EUC0805  [C0805]
C14  1uF  C-EUC0805  [C0805]
C15  1uF  C-EUC0805  [C0805]
C35  100nF  C-EUC0805  [C0805]
ICSP  AVRISP-6  [AVRISP]
LED  PINHD-1X3  [1X03]
R2  4.7k  4.7KOHM-0603-1/10W-1%  [0603]
R3  4.7k  4.7KOHM-0603-1/10W-1%  [0603]
R13  10k  4.7KOHM-0603-1/10W-1%  [0603]
SONIC1  1X4-BIG  [1X04-BIG]
SONIC2  1X4-BIG  [1X04-BIG]
Y2  16MHz  CRYSTAL-16MHZSMD-5X3.2  [CRYSTAL-SMD-5X3.2-4PAD]

### Nets
A_SPI_MISO: ATMEGA328P.16(PB4(MISO)) ICSP.1(MISO) ; also sheet 9
A_SPI_MOSI: ATMEGA328P.15(PB3(MOSI/OC2)) ICSP.4(MOSI) ; also sheet 9
A_SPI_NSS: ATMEGA328P.14(PB2(SS/OC1B)) ; also sheet 9
A_SPI_SCLK: ATMEGA328P.17(PB5(SCK)) ICSP.3(SCK) ; also sheet 9
ADC1: ATMEGA328P.19(ADC6) ; also sheet 2
ADC2: ATMEGA328P.22(ADC7) ; also sheet 2
ECHO1_IN: ATMEGA328P.31(PD1(TXD)) SONIC1.3
ECHO2_IN: ATMEGA328P.24(PC1(ADC1)) SONIC2.3
GND [Supply]: ATMEGA328P.3(GND) ATMEGA328P.5(GND) ATMEGA328P.21(AGND) C10.1 C11.1 C12.2 C13.2 C14.2 C15.2 C35.2 ICSP.6(GND) LED.3 SONIC1.4 SONIC2.4 ; also sheet 1,2,3,4,5,6,7,9
I2C2_SCL: ATMEGA328P.28(PC5(ADC5/SCL)) R3.1 ; also sheet 1
I2C2_SDA: ATMEGA328P.27(PC4(ADC4/SDA)) R2.1 ; also sheet 1
LED: ATMEGA328P.13(PB1(OC1A)) LED.2
N$4: ATMEGA328P.20(AREF) C12.1
N$6: ATMEGA328P.7(PB6(XTAL1/TOSC1)) C10.2 Y2.3
N$7: ATMEGA328P.8(PB7(XTAL2/TOSC2)) C11.2 Y2.1
PPM_IN: ATMEGA328P.32(PD2(INT0)) ; also sheet 2
RST: ATMEGA328P.29(PC6(/RESET)) C35.1 ICSP.5(RST) R13.1 ; also sheet 1,2,6
TRIGG1_IN: ATMEGA328P.30(PD0(RXD)) SONIC1.2
TRIGG2_IN: ATMEGA328P.23(PC0(ADC0)) SONIC2.2
VCC [Supply]: R2.2 R3.2 R13.2 ; also sheet 1,2,3,4,5,6,7,9
VCC_2 [Supply]: ATMEGA328P.4(VCC) ATMEGA328P.6(VCC) ATMEGA328P.18(AVCC) C13.1 C14.1 C15.1 ICSP.2(VCC) LED.1 SONIC1.1 SONIC2.1 ; also sheet 2,3,6,9
Unconnected: ATMEGA328P.1(PD3(INT1)) ATMEGA328P.2(PD4(XCK/T0)) ATMEGA328P.9(PD5(T1)) ATMEGA328P.10(PD6(AIN0)) ATMEGA328P.11(PD7(AIN1)) ATMEGA328P.12(PB0(ICP)) ATMEGA328P.25(PC2(ADC2)) ATMEGA328P.26(PC3(ADC3))

## Sheet 9 of 10: BMP280 with LLC TXB0104
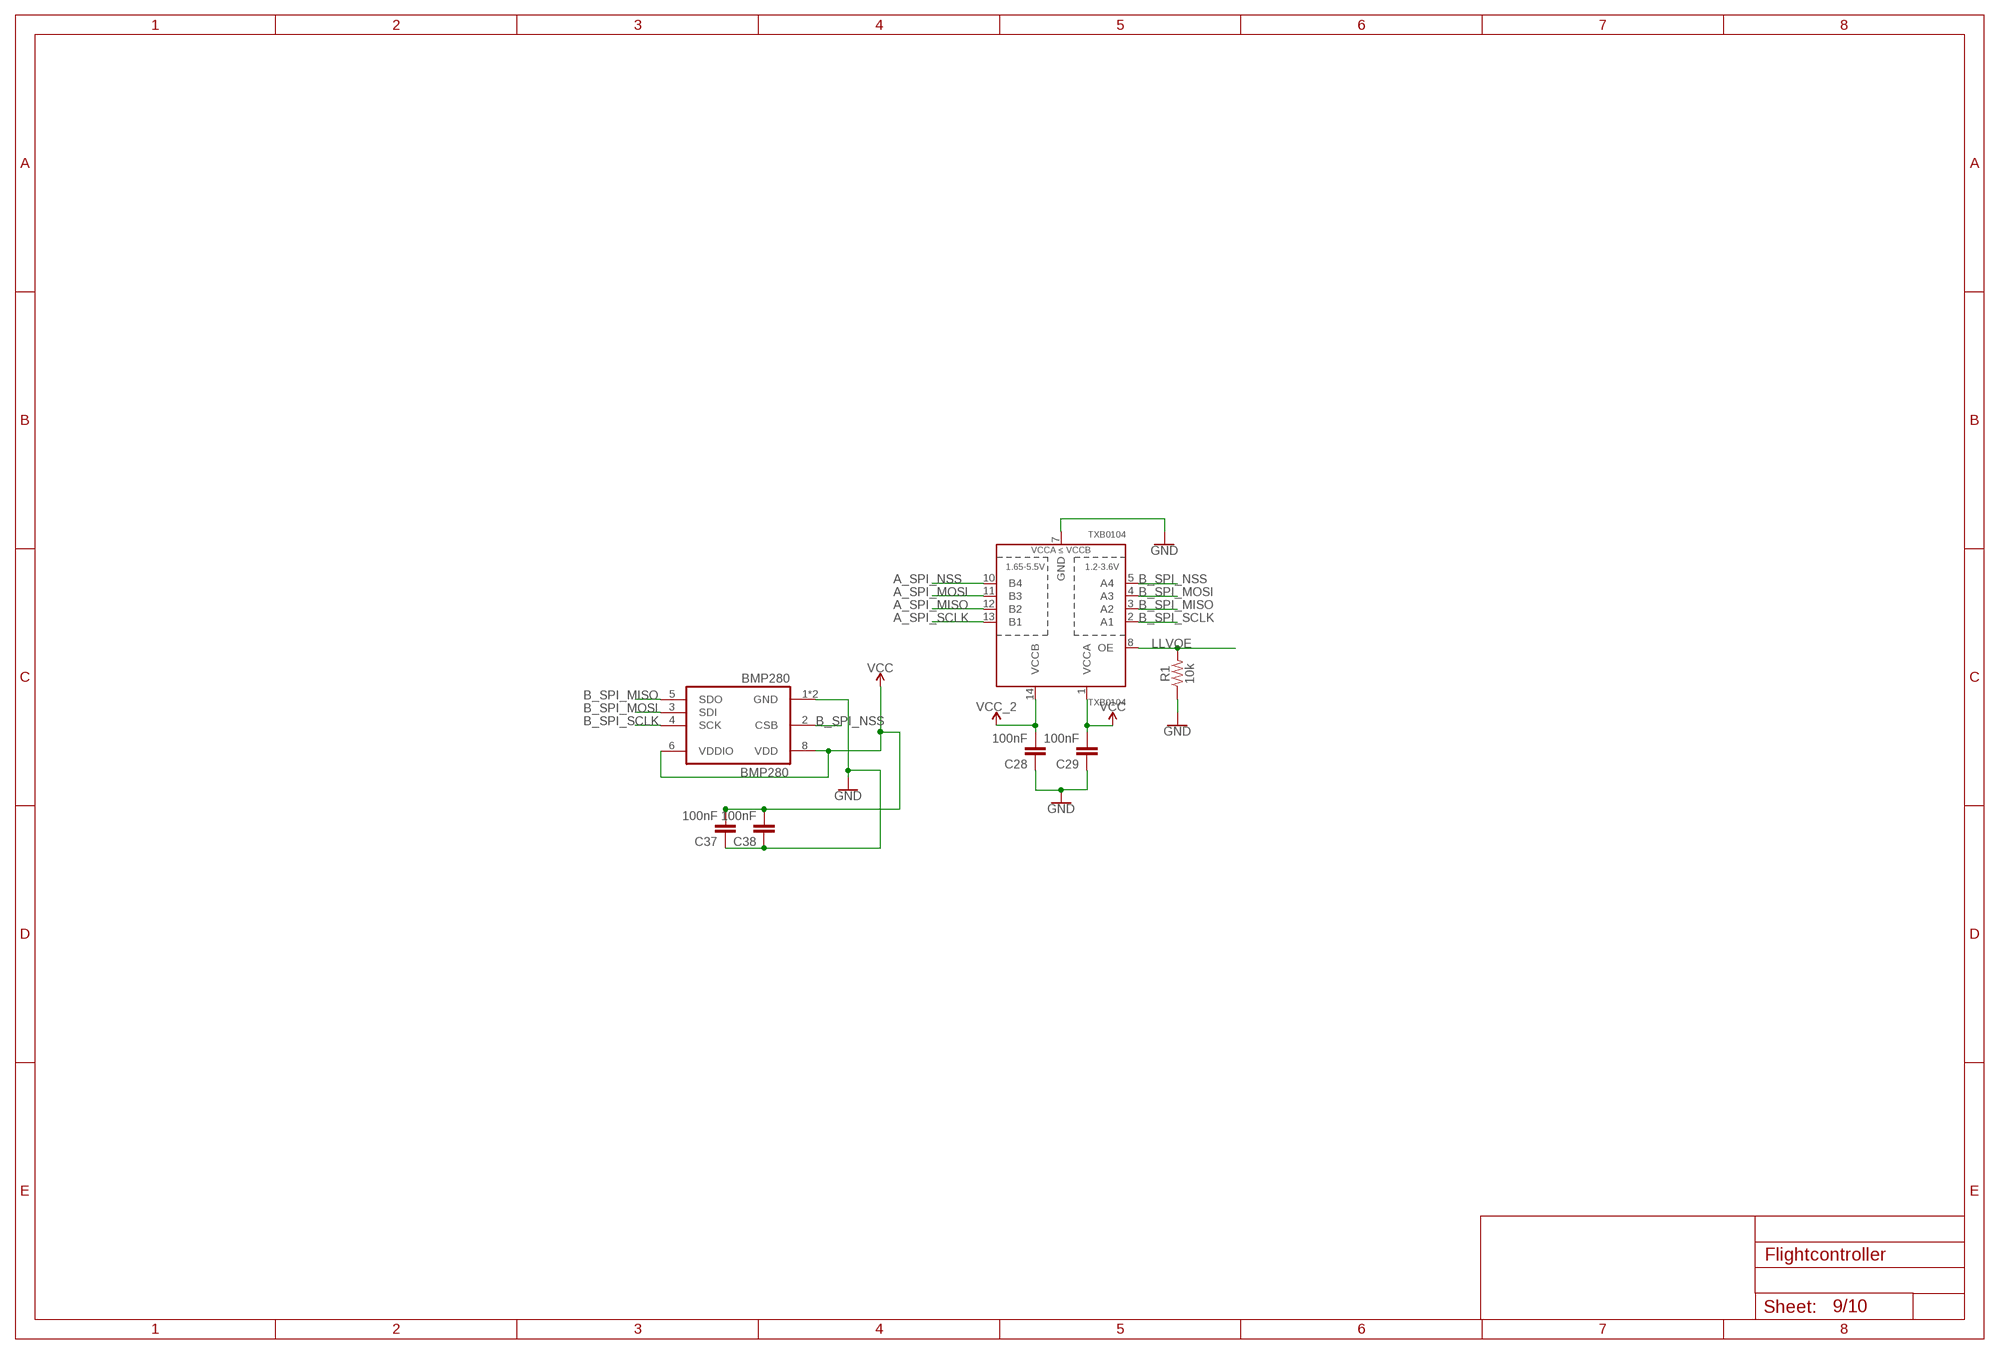
[diagram p8: schematic, sheet 9]

### Parts
BMP280  BMP280  [BMP280]
C28  100nF  C-EUC0805  [C0805]
C29  100nF  C-EUC0805  [C0805]
C37  100nF  C-EUC0805  [C0805]
C38  100nF  C-EUC0805  [C0805]
R1  10k  10KOHM-0603-1/10W-1%  [0603]
TXB0104  TXB0104  TXB0104PWRSOIC14  [SO14]

### Nets
A_SPI_MISO: TXB0104.12(B2) ; also sheet 8
A_SPI_MOSI: TXB0104.11(B3) ; also sheet 8
A_SPI_NSS: TXB0104.10(B4) ; also sheet 8
A_SPI_SCLK: TXB0104.13(B1) ; also sheet 8
B_SPI_MISO: BMP280.5(SDO) TXB0104.3(A2)
B_SPI_MOSI: BMP280.3(SDI) TXB0104.4(A3)
B_SPI_NSS: BMP280.2(CSB) TXB0104.5(A4)
B_SPI_SCLK: BMP280.4(SCK) TXB0104.2(A1)
GND [Supply]: BMP280.1(GND) BMP280.7(GND) C28.1 C29.1 C37.1 C38.1 R1.1 TXB0104.7(GND) ; also sheet 1,2,3,4,5,6,7,8
LLVOE: R1.2 TXB0104.8(OE) ; also sheet 1
VCC [Supply]: BMP280.6(VDDIO) BMP280.8(VDD) C29.2 C37.2 C38.2 TXB0104.1(VCCA) ; also sheet 1,2,3,4,5,6,7,8
VCC_2 [Supply]: C28.2 TXB0104.14(VCCB) ; also sheet 2,3,6,8

## Sheet 10 of 10: MODFACE
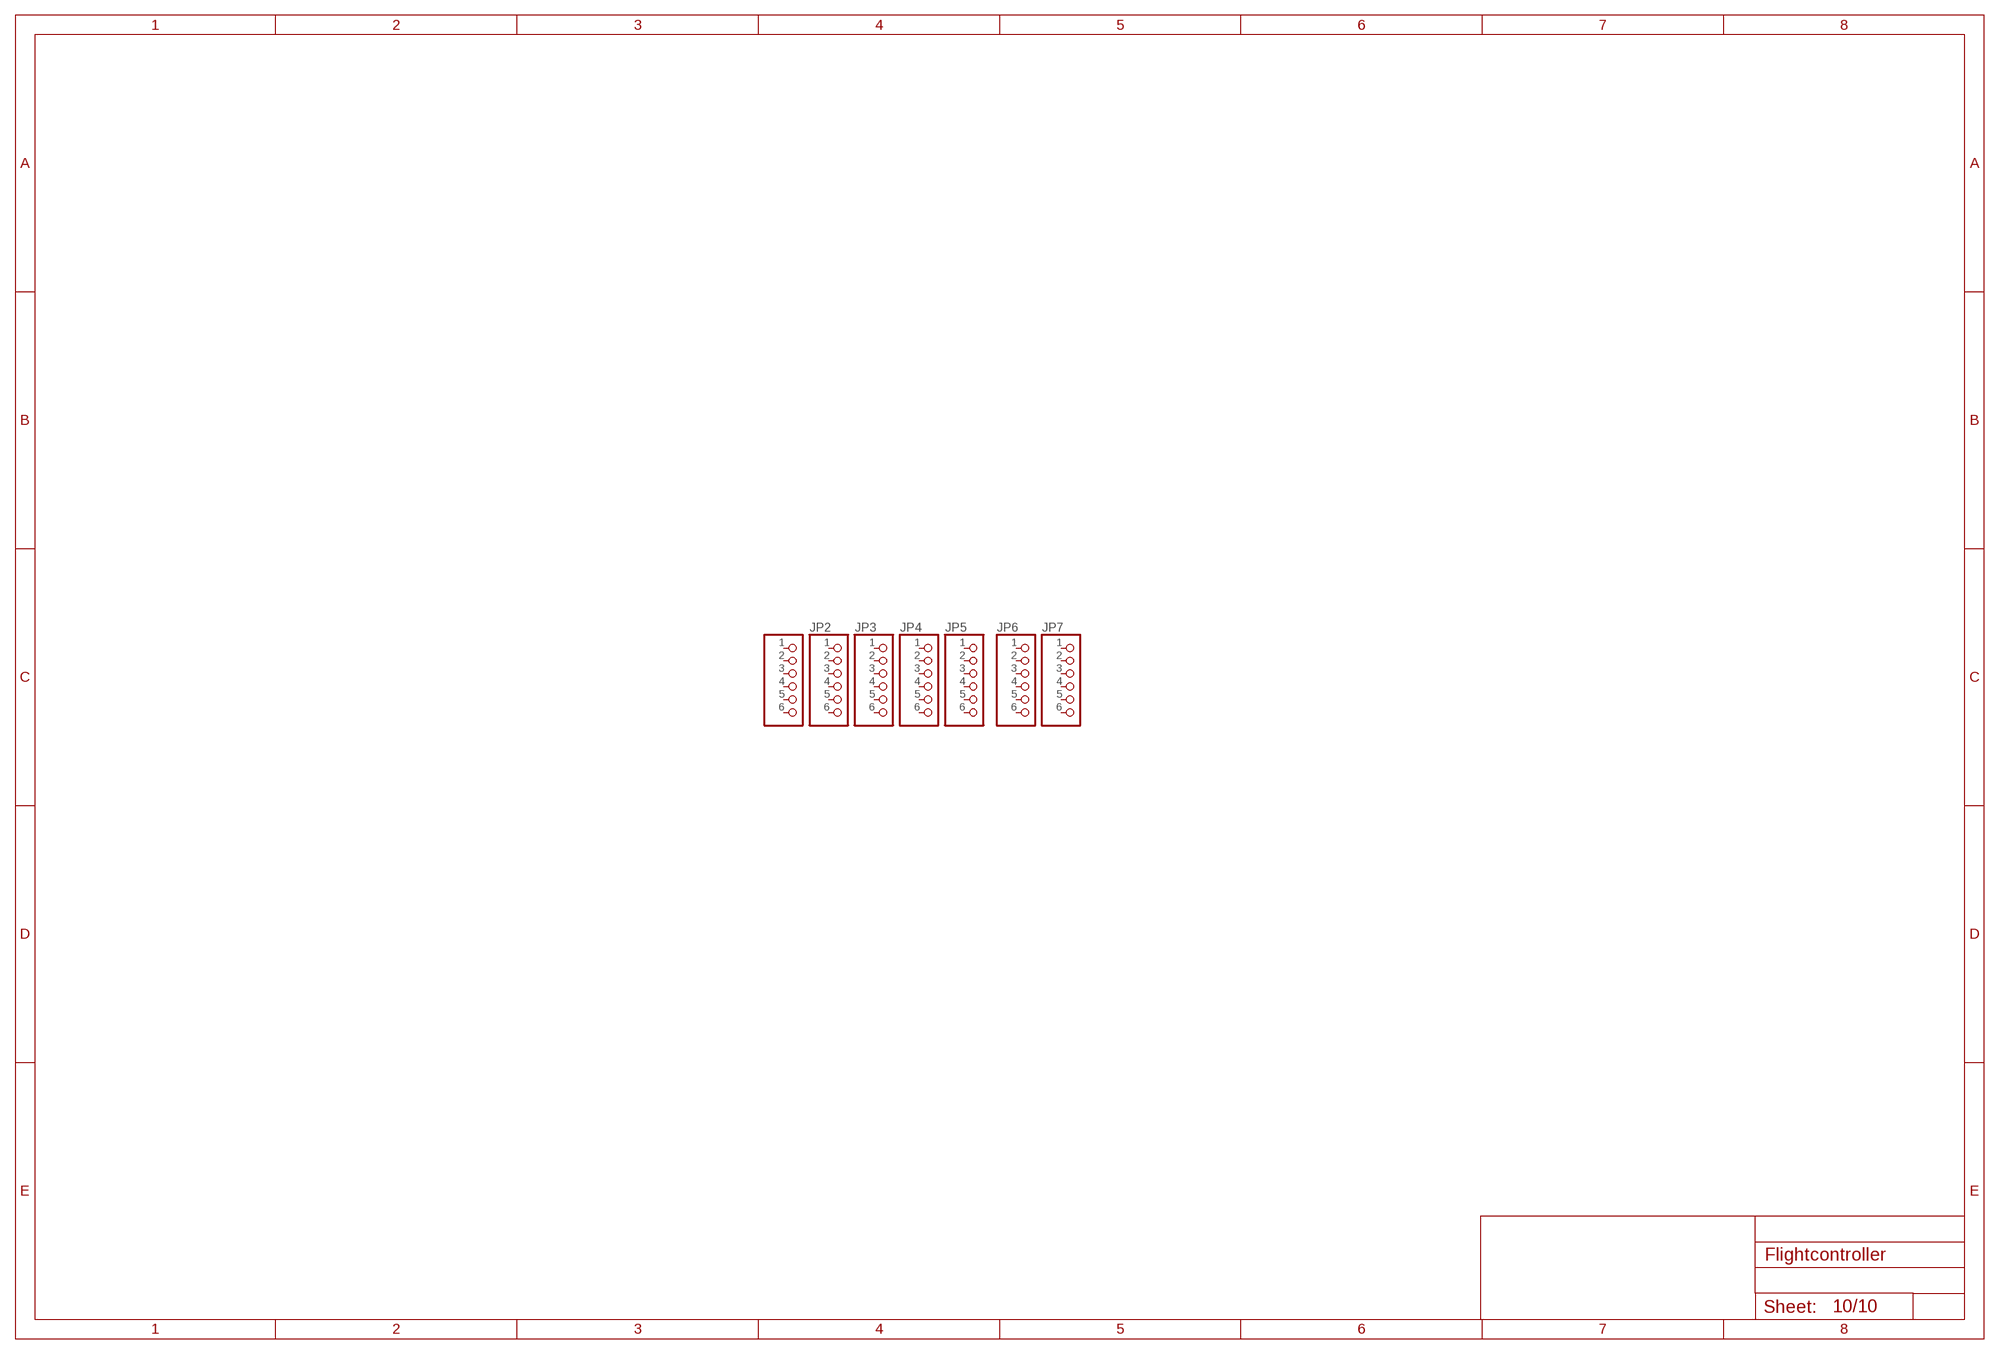
[diagram p9: schematic, sheet 10]

### Parts
JP1  PINHD-1X6  [1X06]
JP2  PINHD-1X6  [1X06]
JP3  PINHD-1X6  [1X06]
JP4  PINHD-1X6  [1X06]
JP5  PINHD-1X6  [1X06]
JP6  PINHD-1X6  [1X06]
JP7  PINHD-1X6  [1X06]
Unconnected: JP1.1 JP1.2 JP1.3 JP1.4 JP1.5 JP1.6 JP2.1 JP2.2 JP2.3 JP2.4 JP2.5 JP2.6 JP3.1 JP3.2 JP3.3 JP3.4 JP3.5 JP3.6 JP4.1 JP4.2 JP4.3 JP4.4 JP4.5 JP4.6 JP5.1 JP5.2 JP5.3 JP5.4 JP5.5 JP5.6 JP6.1 JP6.2 JP6.3 JP6.4 JP6.5 JP6.6 JP7.1 JP7.2 JP7.3 JP7.4 JP7.5 JP7.6

## Power pins joined to a net without a drawn wire
EPX_PAD: ICM20689.25(EPX_PAD)
VBAT: STM32F722.1(B:VBAT)

## Library data of the parts
ADC1 ADC2 DAC GIMBAL_X GIMBAL_Y GIMBAL_Z LED M1-M4 OSD/USB PPM = adafruit:PINHD-1X3: PIN HEADER
ATMEGA328P = SparkFun-IC-Microcontroller:ATMEGA328P_TQFP: Popular 328P in QFP Storefront component: ATmega328 - TQFP <https://www.sparkfun.com/products/13448> (COM-13448) Datasheet <http://www.sparkfun.com/datasheets/Components/SMD/ATMega328.pdf> SparkFun Products SparkFun RedBoard - Programmed with Arduino <https://www.sparkfun.com/products/12757> (DEV-12757) Arduino Pro Mini 328 - 5V/16MHz <https://www.sparkfun.com/products/11113> (DEV-11113) Arduino Pro Mini 328 - 3.3V/8MHz <https://www.sparkfun.com/products/11114> (DEV-11114) SparkFun OpenLog <https://www.sparkfun.com/products/13712> (DEV-13712) SparkFun MicroView - OLED Arduino Module <https://www.sparkfun.com/products/12923> (DEV-12923) SparkFun Digital Sandbox <https://www.sparkfun.com/products/12651> (DEV-12651) SparkFun PicoBoard <https://www.sparkfun.com/products/11888> (WIG-11888) Arduino Fio <https://www.sparkfun.com/products/10116> (DEV-10116) LilyPad Arduino 328 Main Board <https://www.sparkfun.com/products/13342> (DEV-13342) SparkFun RedStick <https://www.sparkfun.com/products/13741> (DEV-13741) LilyPad MP3 <https://www.sparkfun.com/products/11013> (DEV-11013) LilyPad Arduino SimpleSnap <https://www.sparkfun.com/products/10941> (DEV-10941) SparkFun Stepoko <https://www.sparkfun.com/products/13899> (ROB-13899) SparkFun Geiger Counter <https://www.sparkfun.com/products/11345> (SEN-11345) SparkFun EL Sequencer <https://www.sparkfun.com/products/12781> (COM-12781) Arduino Pro 328 - 5V/16MHz <https://www.sparkfun.com/products/10915> (DEV-10915) CryptoCape <https://www.sparkfun.com/products/12773> (DEV-12773) SparkFun IR Thermometer Evaluation Board - MLX90614 <https://www.sparkfun.com/products/10740> (SEN-10740) SparkFun RedBot Mainboard <https://www.sparkfun.com/products/12097> (ROB-12097) Arduino Pro 328 - 3.3V/8MHz <https://www.sparkfun.com/products/10914> (DEV-10914) SparkFun Block for Intel® Edison - Arduino <https://www.sparkfun.com/products/13036> (DEV-13036) SparkFun Simon Says - Surface Mount Soldering Kit <https://www.sparkfun.com/products/10935> (KIT-10935) SparkFun 7-Segment Serial Display - Red <https://www.sparkfun.com/products/11441> (COM-11441) SparkFun 7-Segment Serial Display - White <https://www.sparkfun.com/products/11629> (COM-11629) SparkFun 7-Segment Serial Display - Yellow <https://www.sparkfun.com/products/11443> (COM-11443) SparkFun 7-Segment Serial Display - Kelly Green <https://www.sparkfun.com/products/11440> (COM-11440) SparkFun 7-Segment Serial Display - Blue <https://www.sparkfun.com/products/11442> (COM-11442) SparkFun OpenSegment Serial Display - 20mm (Blue) <https://www.sparkfun.com/products/11647> (COM-11647) SparkFun OpenSegment Serial Display - 20mm (Green) <https://www.sparkfun.com/products/11646> (COM-11646) SparkFun OpenSegment Serial Display - 20mm (White) <https://www.sparkfun.com/products/11648> (COM-11648) SparkFun OpenSegment Serial Display - 20mm (Red) <https://www.sparkfun.com/products/11644> (COM-11644) SparkFun OpenSegment Serial Display - 20mm (Yellow) <https://www.sparkfun.com/products/11645> (COM-11645) SparkFun OpenSegment Shield <https://www.sparkfun.com/products/13190> (DEV-13190); PROD_ID: IC-09069
BATT_SENS JP8 = adafruit:PINHD-1X1: Pin header 1x1 for 0.1" spacing With round pins
BMP280 = bosch-bmp280:BMP280: The BMP280 is an absolute barometric pressure sensor especially designed for mobile applications. The sensor module is housed in an extremely compact 8-pin metal-lid LGA package with a footprint of only 2.0 × 2.5 mm2 and 0.95 mm package height. Its small dimensions and its low power consumption of 2.7 μA @1Hz allow the implementation in battery driven devices such as mobile phones, GPS modules or watches. The library has been designed by Richard Magdycz <https://www.facebook.com/groups/eaglecadsoftUK>
C1 C2 C13 C20 C21 C27 = resistor:C-EU: CAPACITOR, European symbol
C3-C12 C14-C19 C22 C23 C28-C42 = rcl:C-EU: CAPACITOR, European symbol; SPICEPREFIX: C
D1 = diode:DIODE-: DIODE
FT232RL = ftdichip:FT232R: Source: http://www.ftdichip.com/Documents/DataSheets/DS_FT232R_v104.pdf; MPN: FT232RL; OC_FARNELL: 1146032; OC_NEWARK: 91K9918
GPS OSD SONIC1 SONIC2 = adafruit:1X4: 4-pin connector
GY87 = adafruit:PINHD-1X8: PIN HEADER
ICM20689 = ICM-20689:ICM-20689: 6-Axis Drone/Vr/Iot Solution (Pi); AVAILABILITY: Unavailable; DESCRIPTION: 6-Axis Drone/Vr/Iot Solution _Pi; MF: TDK InvenSense; MP: ICM-20689; PACKAGE: QFN-24 InvenSense; PRICE: None
ICSP = adafruit:AVRISP: AVR ISP HEADER Standard 6 pin header for AVR programming
JP1-JP7 JTAG = adafruit:PINHD-1X6: PIN HEADER
LED1-LED6 = adafruit:LED: LED OSRAM: - CHIPLED LG R971, LG N971, LY N971, LG Q971, LY Q971, LO R971, LY R971 LH N974, LH R974 LS Q976, LO Q976, LY Q976 LO Q996 - Hyper CHIPLED LW Q18S LB Q993, LB Q99A, LB R99A - SideLED LS A670, LO A670, LY A670, LG A670, LP A670 LB A673, LV A673, LT A673, LW A673 LH A674 LY A675 LS A676, LA A676, LO A676, LY A676, LW A676 LS A679, LY A679, LG A679 - Hyper Micro SIDELED® LS Y876, LA Y876, LO Y876, LY Y876 LT Y87S - SmartLED LW L88C, LW L88S LB L89C, LB L89S, LG L890 LS L89K, LO L89K, LY L89K LS L896, LA L896, LO L896, LY L896 - TOPLED LS T670, LO T670, LY T670, LG T670, LP T670 LSG T670, LSP T670, LSY T670, LOP T670, LYG T670 LG T671, LOG T671, LSG T671 LB T673, LV T673, LT T673, LW T673 LH T674 LS T676, LA T676, LO T676, LY T676, LB T676, LH T676, LSB T676, LW T676 LB T67C, LV T67C, LT T67C, LS T67K, LO T67K, LY T67K, LW E67C LS E67B, LA E67B, LO E67B, LY E67B, LB E67C, LV E67C, LT E67C LW T67C LS T679, LY T679, LG T679 LS T770, LO T770, LY T770, LG T770, LP T770 LB T773, LV T773, LT T773, LW T773 LH T774 LS E675, LA E675, LY E675, LS T675 LS T776, LA T776, LO T776, LY T776, LB T776 LHGB T686 LT T68C, LB T68C - Hyper Mini TOPLED® LB M676 - Mini TOPLED Santana® LG M470 LS M47K, LO M47K, LY M47K Source: http://www.osram.convergy.de/
LM3940-3.3 = LM3940IMPX-3.3_NOPB:LM3940IMPX-3.3/NOPB: Low Dropout Regulator; AVAILABILITY: Unavailable; DESCRIPTION: 1A Low Dropout egulator for 5V to 3.3V Conversion 4-SOT-223 -40 to 125; MF: Texas Instruments; MP: LM3940IMPX-3.3/NOPB; PACKAGE: SOT-223-4 Texas Instruments; PRICE: None
NRF24L01 = NRF24l01+:NRF24L01+: nRF24L01+ Transceiver Module
R1 R6 = SparkFun-Resistors:10KOHM: 10kΩ resistor A resistor is a passive two-terminal electrical component that implements electrical resistance as a circuit element. Resistors act to reduce current flow, and, at the same time, act to lower voltage levels within circuits. - Wikipedia; PROD_ID: RES-00824
R2-R5 = SparkFun-Resistors:4.7KOHM: 4.7kΩ resistor A resistor is a passive two-terminal electrical component that implements electrical resistance as a circuit element. Resistors act to reduce current flow, and, at the same time, act to lower voltage levels within circuits. - Wikipedia; PROD_ID: RES-07857
R7-R12 = SparkFun-Resistors:10KOHM: 10kΩ resistor A resistor is a passive two-terminal electrical component that implements electrical resistance as a circuit element. Resistors act to reduce current flow, and, at the same time, act to lower voltage levels within circuits. - Wikipedia; PROD_ID: RES-00824; VALUE: 10k
R13 = SparkFun-Resistors:4.7KOHM: 4.7kΩ resistor A resistor is a passive two-terminal electrical component that implements electrical resistance as a circuit element. Resistors act to reduce current flow, and, at the same time, act to lower voltage levels within circuits. - Wikipedia; PROD_ID: RES-07857; VALUE: 4.7k
RESET = adafruit:SWITCH_PUSHBUTTON: Buttons SOFTTOUCHSMD_SJ - Soft touch temporary push button (Super Junk Akihabara) Compatible with SKPMANE010 [Mouser: 688-SKPMAN] C&K_KSS = Digikey: KSS221GLFS
SD_CARD = 2908-05WB-MG:2908-05WB-MG: 2908-05WB-MG Conn Micro S D Card HDR 8 POS 1.1mm So lder RA SMD T/R 0.5A RoHS; AVAILABILITY: Unavailable; DESCRIPTION: 2908-05WB-MG Conn Micro S D Card HDR 8 POS 1.1mm So lder RA SMD T/R 0.5A RoHS; MF: 3M; MP: 2908-05WB-MG; PACKAGE: None; PRICE: None
STM32F722 = STMF22RET6:STM32F7X2RXT; MANUFACTURER_PART_NUMBER: STM32F7X2RXT; VENDOR: STMicroelectronics
TXB0104 = SparkFun-IC-Comms:TXB0104PWR: 4-Bit Bi-Directional Level Shifter 1.2V-3.6V (VCCA) to 1.65V-5.5V (VCCB) bi-directional level shifter with auto direction sensing. Max data rate - VCCA 1.8V: 20Mbps (50ns), VCCA 3.3V: 100Mbps (10ns) Digikey: 296-21929-1-ND (TSSOP) Datasheet <http://cdn.sparkfun.com/datasheets/BreakoutBoards/txb0104.pdf> SparkFun Products SparkFun Cellular Shield - MG2639 <https://www.sparkfun.com/products/13120> (CEL-13120) SparkFun Level Shifting microSD Breakout <https://www.sparkfun.com/products/13743> (DEV-13743) SparkFun Voltage-Level Translator Breakout - TXB0104 <https://www.sparkfun.com/products/11771> (BOB-11771) SparkFun Block for Intel® Edison - UART <https://www.sparkfun.com/products/13040> (DEV-13040) SparkFun Block for Intel® Edison - Arduino <https://www.sparkfun.com/products/13036> (DEV-13036); PROD_ID: IC-11329
USB = SparkFun-Connectors:USB_MICRO-B: USB Type Micro-B Connector Male/female and PTH/SMT variants SparkFun Products: SparkFun microB USB Breakout <https://www.sparkfun.com/products/12035> SparkFun USB microB Plug Breakout <https://www.sparkfun.com/products/10031> SparkFun ESP8266 Thing <https://www.sparkfun.com/products/13231>; PROD_ID: CONN-09505; SF_ID: PRT-08533
Y1 = SparkFun-Clocks:CRYSTAL-8MHZ: 8MHz Crystal Datasheet Example <http://www.futureelectronics.com/en/technologies/electromechanical/timing-devices/crystals/Pages/6008189-ABM3B-8.000MHZ-B2-T.aspx?IM=0> Frequency: 8MHz Frequency Tolerance: ±20ppm Load Capacitance: 18pF SparkFun Products: Pro Micro -3.3V/8MHz <https://www.sparkfun.com/products/12587> WAV Trigger <https://www.sparkfun.com/products/13660>; PROD_ID: XTAL-09431
Y2 = SparkFun-Clocks:CRYSTAL-16MHZ: 16MHz Crystal Digikey Example <http://www.digikey.com/product-search/en?keywords=535-9122-1-ND> Frequency: 16MHz Frequency Stability: ±50ppm Frequency Tolerance: ±20ppm Load Capacitance: 18pF SparkFun Products: Pro Micro -5V/16MHz <https://www.sparkfun.com/products/12640> SparkFun Serial Enabled LCD Kit <https://www.sparkfun.com/products/10097>; PROD_ID: XTAL-08218; SF_ID: COM-00094

## Net classes
0 default: width 0.102 mm, drill 0.102 mm, clearance 0.102 mm
1 Supply: width 0.203 mm, drill 0.254 mm, clearance 0.102 mm